# EAGLE board H3-Rev_A (EAGLE 9.6.2), part 1 of 4
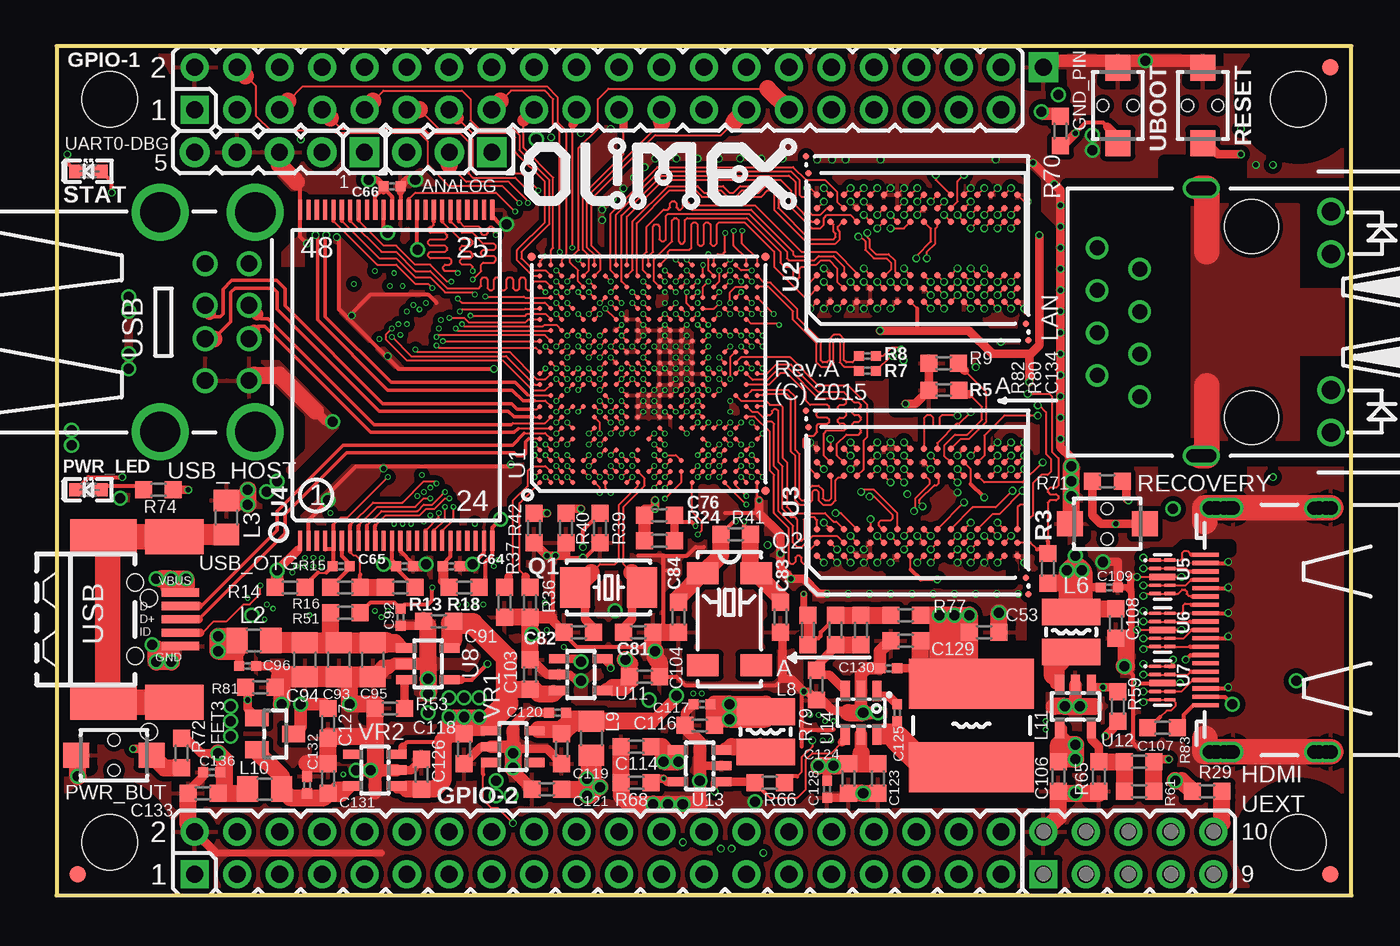
[diagram p5: board, top side]
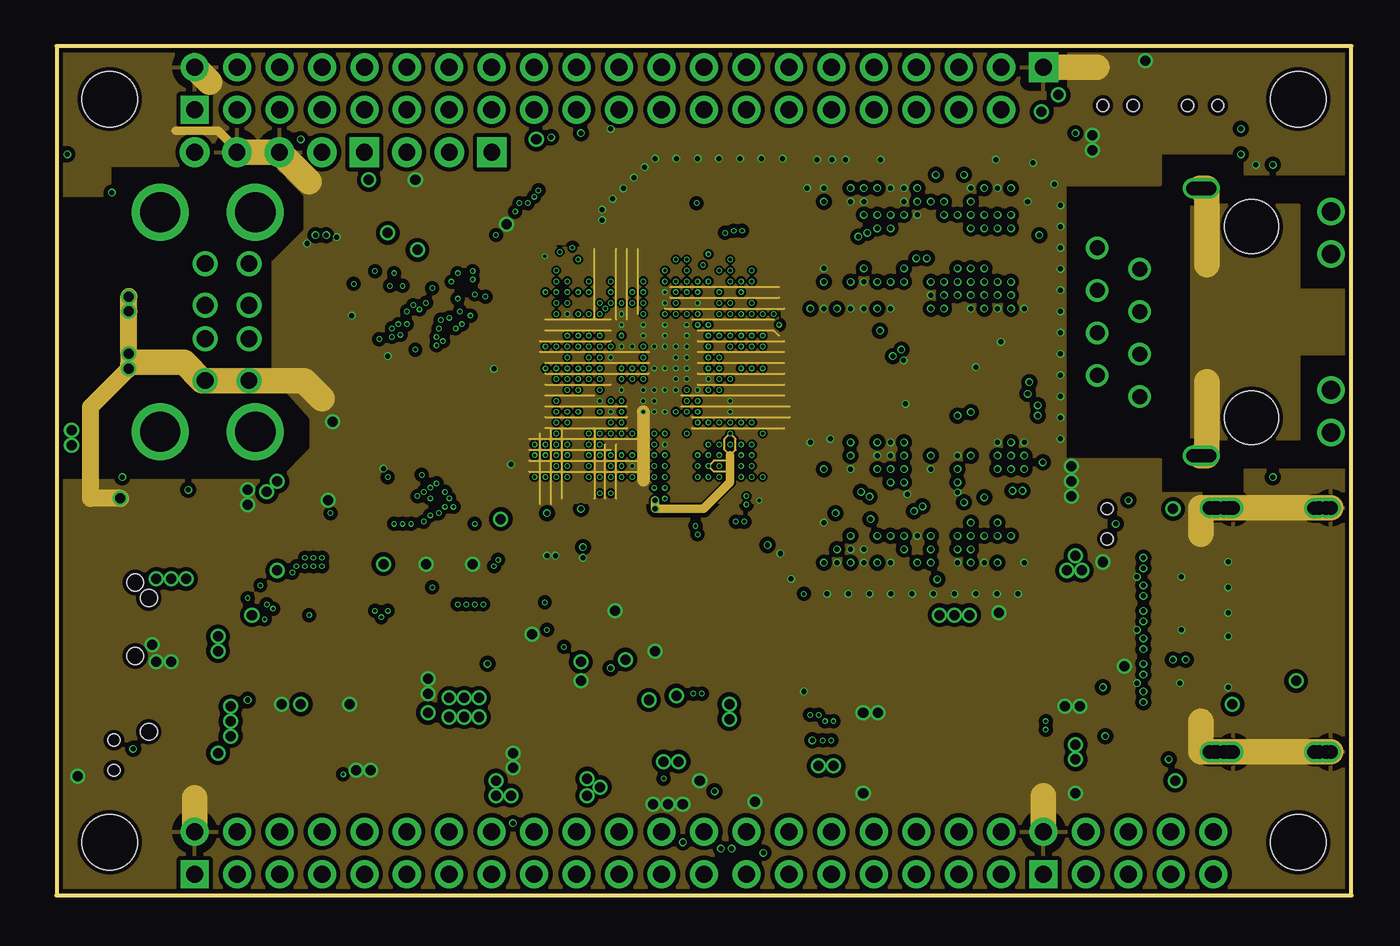
[diagram p6: board, inner layer GND]
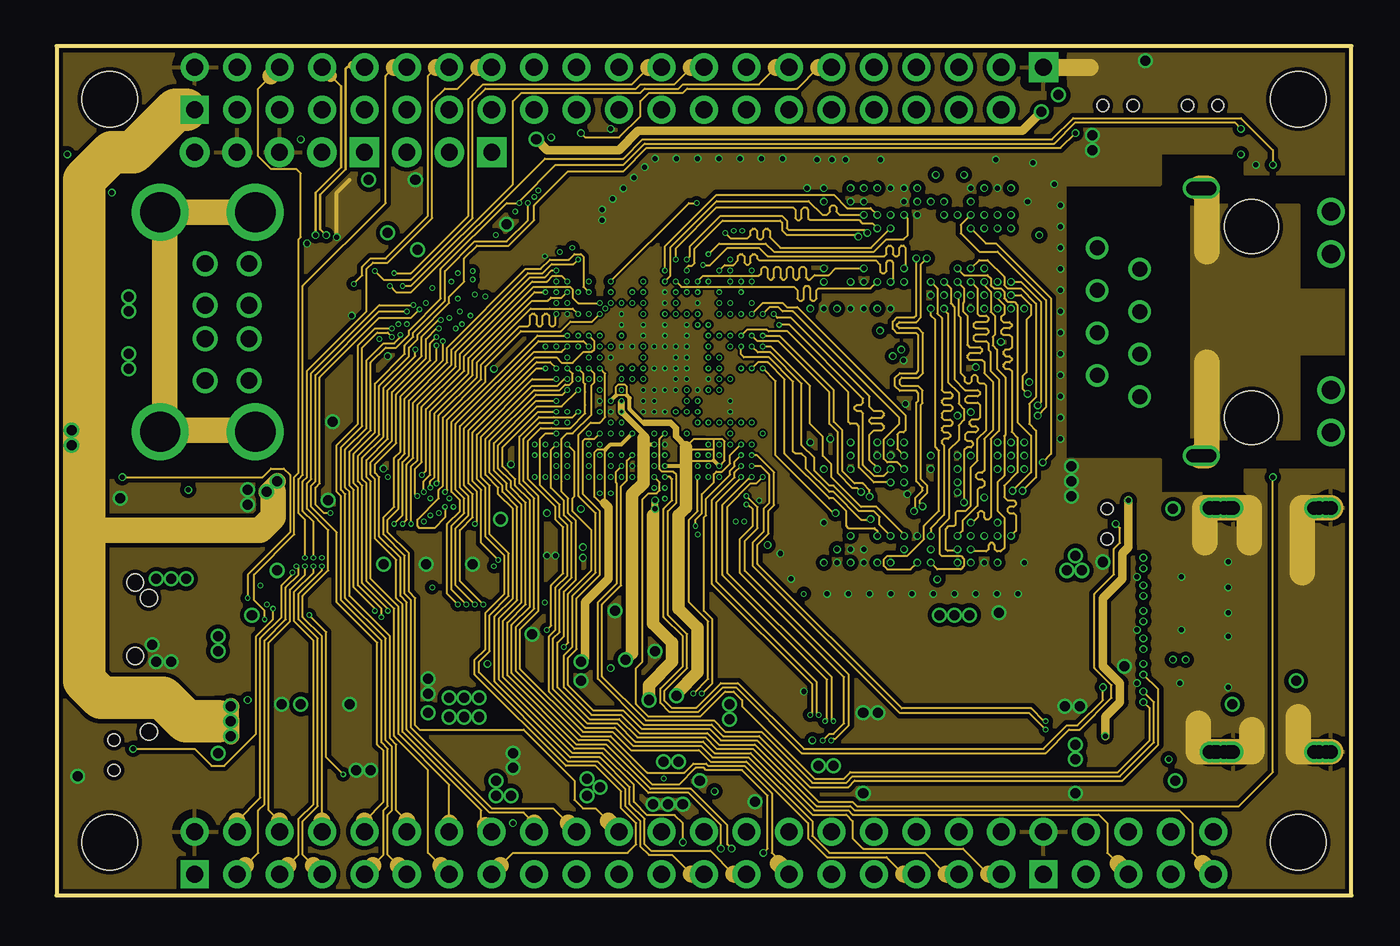
[diagram p7: board, inner layer Route3]
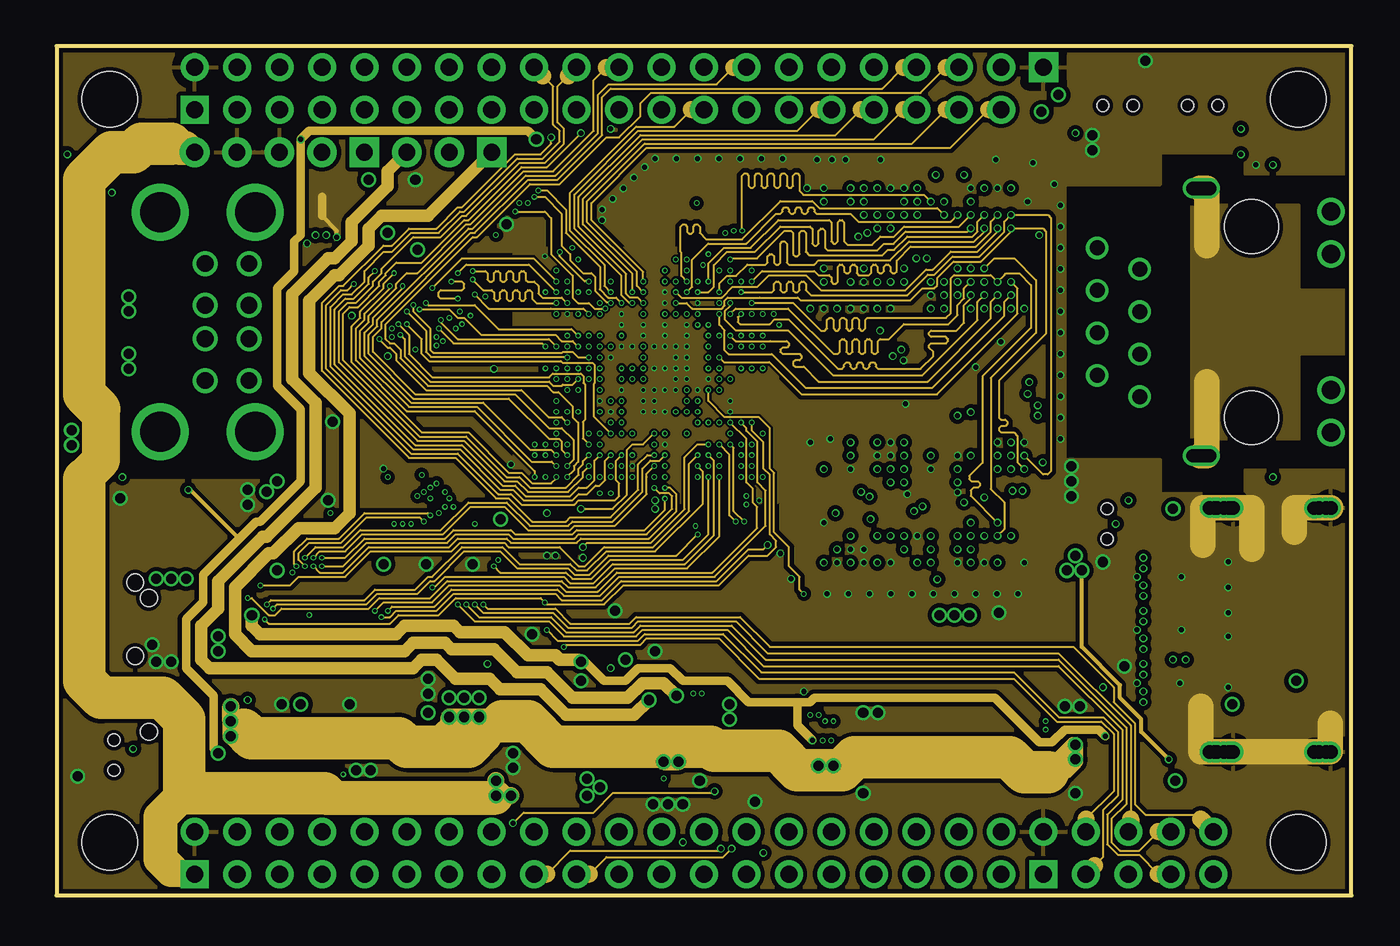
[diagram p8: board, inner layer Route14]
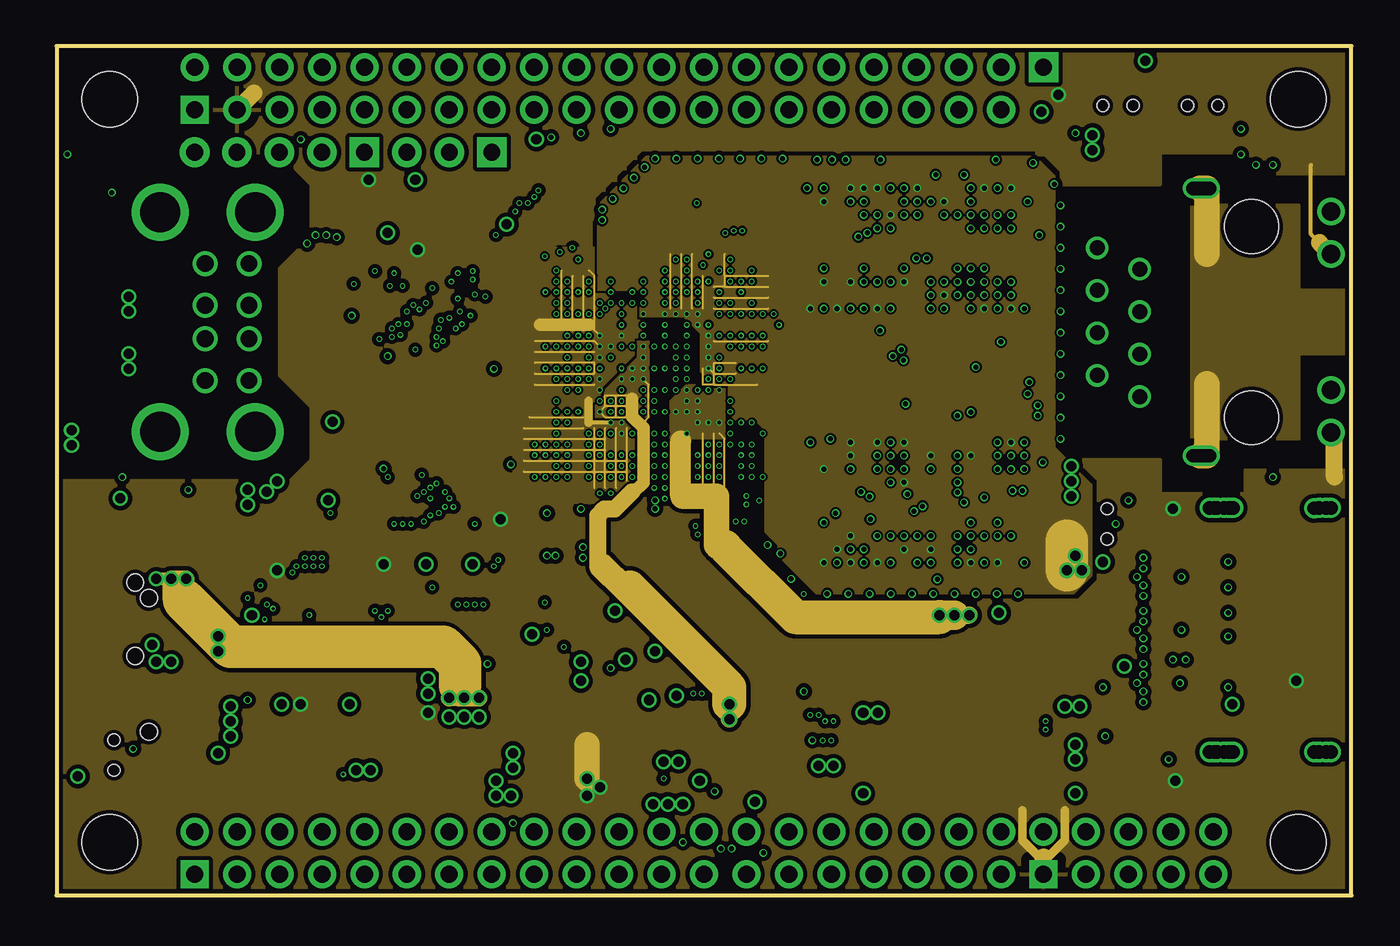
[diagram p9: board, inner layer PWR]
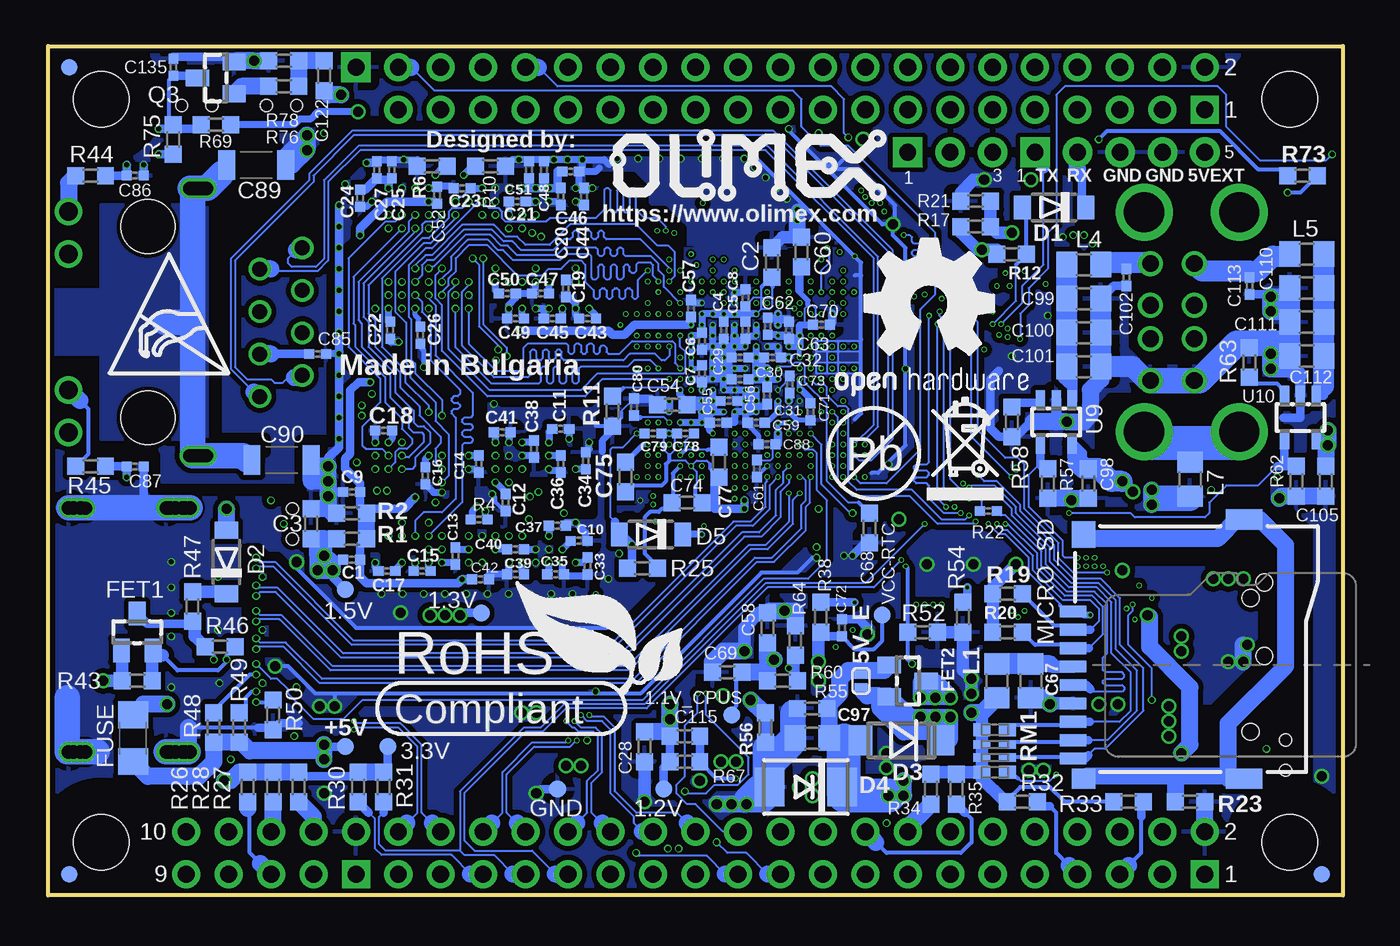
[diagram p10: board, bottom side, seen from below]

Size 77.47 x 50.8 mm. Coordinates in mm from the lower left corner, seen from the top.
Outline: 0,50.8 0,0 77.47,0 77.47,50.8 0,50.8
Copper layers (1+2*3+14*15+16): Top 0.035mm / dielectric 5mil / GND 0.035mm / dielectric 0.5mm / Route3 0.035mm / dielectric 0.2mm / Route14 0.035mm / dielectric 0.5mm / PWR 0.035mm / dielectric 5mil / Bottom 0.035mm
Design rules "default": minimum track width 4mil, minimum drill 0.2mm, track to track 5mil, track to pad 5mil, pad to pad 5mil, via to via 5mil, smd to smd 1mil, copper to edge 10mil, drill to drill 8mil, minimum pad ring 6mil, minimum via ring 2.5mil, stop-mask expansion 4mil, vias tented up to drill 28mil, thermal gap 20mil
Holes 3.3 mm at 3.17,47.62 74.3,47.62 3.17,3.17 74.3,3.17
tRestrict: area -0.3,-0.3 to 6.6,6.6; area -0.3,44.2 to 6.6,51.1; area 70.9,-0.3 to 77.7,6.6; area 70.9,44.2 to 77.7,51.1; 104 lines
bRestrict: area -0.3,-0.3 to 6.6,6.6; area -0.3,44.2 to 6.6,51.1; area 70.9,-0.3 to 77.7,6.6; area 70.9,44.2 to 77.7,51.1; 143 lines

## Footprints (pad centres in the part's own frame; a part is rotated, then mirrored left to right if it is on the bottom)
TESTPAD_40-ROUND = smd 1.016 x 1.016: 1 0,0
SJ_1_SMALLER = smd 0.508 x 0.762: 1 -0.381,0; 2 0.381,0
HN1X3 = drill 1 pad 1.778 square: 1 -2.54,0 | drill 1 pad 1.778: 2 0,0; 3 2.54,0
C0402_TI = smd 0.61 x 0.584: 1 -0.508,0; 2 0.508,0
C0603_DWS = smd 1.016 x 1.016: 1 -0.889,0; 2 0.889,0
C0805_5MIL_DWS = smd 1.27 x 1.524: 1 -1.016,0; 2 1.016,0
C1206_5MILS_WS_ISO = smd 1.016 x 1.778: 1 -1.778,0; 2 1.778,0
SOD-123 = smd 1 x 1.4: A 1.9,0; C -1.9,0
MLL-41 = smd 1.45 x 1.8: A 2.445,0; K -2.445,0
DO214AA = smd 1.778 x 2.286: A 2.177,0; C -2.177,0
SOT23 = smd 1.4 x 1: 1 1.1,-0.95; 2 1.1,0.95; 3 -1.1,0
FIDUCIAL-1X3 = smd 1 x 1: 1 0,0
1206 = smd 1.6 x 1.8: 1 -1.4,0; 2 1.4,0
TEST_PAD40/70/SQUARE = drill 1.016 pad 1.778 square: P$1 0,0
HN2X20-MALE = drill 1.016 pad 1.676 square: 1 -24.13,-1.27 | drill 1.016 pad 1.676: 2 -24.13,1.27; 3 -21.59,-1.27; 4 -21.59,1.27; 5 -19.05,-1.27; 6 -19.05,1.27; 7 -16.51,-1.27; 8 -16.51,1.27; 9 -13.97,-1.27; 10 -13.97,1.27; 11 -11.43,-1.27; 12 -11.43,1.27; 13 -8.89,-1.27; 14 -8.89,1.27; 15 -6.35,-1.27; 16 -6.35,1.27; 17 -3.81,-1.27; 18 -3.81,1.27; 19 -1.27,-1.27; 20 -1.27,1.27; 21 1.27,-1.27; 22 1.27,1.27; 23 3.81,-1.27; 24 3.81,1.27; 25 6.35,-1.27; 26 6.35,1.27; 27 8.89,-1.27; 28 8.89,1.27; 29 11.43,-1.27; 30 11.43,1.27; 31 13.97,-1.27; 32 13.97,1.27; 33 16.51,-1.27; 34 16.51,1.27; 35 19.05,-1.27; 36 19.05,1.27; 37 21.59,-1.27; 38 21.59,1.27; 39 24.13,-1.27; 40 24.13,1.27
HDMI-SWM-19 = smd 0.25 x 1.6: 1 -4.5,-5.55; 2 -4,-5.55; 3 -3.5,-5.55; 4 -3,-5.55; 5 -2.5,-5.55; 6 -2,-5.55; 7 -1.5,-5.55; 8 -1,-5.55; 9 -0.5,-5.55; 10 0,-5.55; 11 0.5,-5.55; 12 1,-5.55; 13 1.5,-5.55; 14 2,-5.55; 15 2.5,-5.55; 16 3,-5.55; 17 3.5,-5.55; 18 4,-5.55; 19 4.5,-5.55 | drill 0.8: P$5 -7.3,-4.85; P$7 -7.3,1.25; P$9 7.3,1.25; P$11 7.3,-4.85; P$13 -7.3,-4.45; P$15 -7.3,1.65; P$18 7.3,1.65; P$20 7.3,-4.45; P$21 -7.3,-4.15; P$22 -7.3,-5; P$23 7.3,-5; P$24 7.3,-4.15; P$25 -7.3,-5.3; P$26 7.3,-5.3; P$27 7.3,0.95; P$28 -7.275,0.95; SH1 -7.3,-3.9; SH2 -7.3,1.95; SH3 7.3,1.95; SH4 7.3,-3.9
L0805_5MIL_DWS = smd 1.27 x 1.524: 1 -1.016,0; 2 1.016,0
CD32 = smd 1.6 x 3.5: 1 -1.2,0; 2 1.2,0
CD73(75) = smd 3 x 7.5: 1 -2.5,0; 2 2.5,0
RJLBC-060TC1_MILLING = drill 0.9: 1 -4.455,6.7; 2 -3.185,9.24; 3 -1.915,6.7; 4 -0.645,9.24; 5 0.625,6.7; 6 1.895,9.24; 7 3.165,6.7; 8 4.435,9.24 | drill 0.8: _1 -8,2.5; _2 -8,2.7; _3 -8,2.9; _4 -8,3.3; _5 -8,3.5; _6 8,3.5; _7 8,3.3; _8 8,2.9; _9 8,2.7; _10 8,2.5; GND1 -8,3.1; GND2 8,3.1 | drill 1.1: AG 4.07,-4.748; AY -6.61,-4.748; KG 6.61,-4.748; KY -4.07,-4.748 | hole 3.2: -5.715,0; 5.715,0
TFC-WPAPR-08 = smd 1.6 x 0.7: 1 -7.375,2.25; 2 -7.375,1.15; 3 -7.375,0.05; 4 -7.375,-1.05; 5 -7.375,-2.15; 6 -7.375,-3.25; 7 -7.375,-4.35; 8 -7.375,-5.45; 9 -7.375,-6.55 | smd 1.4 x 1.2: 10 -6.75,-7.75 | smd 1.4 x 1.6: 11 -6.75,6.85 | smd 2.2 x 1.2: 12 2.85,-7.75; 13 2.85,7.75 | hole 1: 3.25,-4.95; 3.25,3.05
IT1185AU2 = smd 1.55 x 1.5: 1 -2.25,0; 2 2.25,0 | hole 0.7: 0,-0.9; 0,0.9
LED-0603_TEST = smd 0.8 x 0.8: A 0.762,0; C -0.762,0
HCX-4S = smd 1.8 x 2.4: 1 -2,0; 2 2,0
MC-306 = smd 1.3 x 1.9: 1 -2.75,-1.6; 2 2.75,-1.6; 3 2.75,1.6; 4 -2.75,1.6
R0603_5MIL_DWS = smd 1.016 x 1.016: 1 -0.889,0; 2 0.889,0
R0402_TI = smd 0.61 x 0.584: 1 -0.508,0; 2 0.508,0
0603_0R = smd 1.016 x 1.016: 1 -0.889,0; 2 0.889,0
R_MATRIX_4 = smd 0.762 x 1.016: 1.1 -1.27,-0.762; 1.2 -1.27,0.762; 4.1 1.27,-0.762; 4.2 1.27,0.762 | smd 0.508 x 1.016: 2.1 -0.381,-0.762; 2.2 -0.381,0.762; 3.1 0.381,-0.762; 3.2 0.381,0.762
FBGA-347 = smd 0.3 x 0.3: A1 -6.5,-6.5; A2 -6.5,-5.85; A3 -6.5,-5.2; A4 -6.5,-4.55; A5 -6.5,-3.9; A7 -6.5,-2.6; A8 -6.5,-1.95; A10 -6.5,-0.65; A11 -6.5,0; A13 -6.5,1.3; A14 -6.5,1.95; A16 -6.5,3.25; A17 -6.5,3.9; A19 -6.5,5.2; A20 -6.5,5.85; A21 -6.5,6.5; AA1 6.5,-6.5; AA2 6.5,-5.85; AA3 6.5,-5.2; AA5 6.5,-3.9; AA6 6.5,-3.25; AA8 6.5,-1.95; AA9 6.5,-1.3; AA11 6.5,0; AA12 6.5,0.65; AA14 6.5,1.95; AA15 6.5,2.6; AA17 6.5,3.9; AA18 6.5,4.55; AA19 6.5,5.2; AA20 6.5,5.85; AA21 6.5,6.5; B1 -5.85,-6.5; B2 -5.85,-5.85; B3 -5.85,-5.2; B4 -5.85,-4.55; B5 -5.85,-3.9; B6 -5.85,-3.25; B7 -5.85,-2.6; B8 -5.85,-1.95; B9 -5.85,-1.3; B10 -5.85,-0.65; B11 -5.85,0; B12 -5.85,0.65; B13 -5.85,1.3; B14 -5.85,1.95; B15 -5.85,2.6; B16 -5.85,3.25; B17 -5.85,3.9; B18 -5.85,4.55; B19 -5.85,5.2; B20 -5.85,5.85; B21 -5.85,6.5; C1 -5.2,-6.5; C2 -5.2,-5.85; C3 -5.2,-5.2; C5 -5.2,-3.9; C6 -5.2,-3.25; C7 -5.2,-2.6; C8 -5.2,-1.95; C9 -5.2,-1.3; C10 -5.2,-0.65; C11 -5.2,0; C12 -5.2,0.65; C13 -5.2,1.3; C14 -5.2,1.95; C15 -5.2,2.6; C16 -5.2,3.25; C17 -5.2,3.9; C18 -5.2,4.55; C19 -5.2,5.2; C20 -5.2,5.85; C21 -5.2,6.5; D1 -4.55,-6.5; D2 -4.55,-5.85; D3 -4.55,-5.2; D5 -4.55,-3.9; D6 -4.55,-3.25; D8 -4.55,-1.95; D10 -4.55,-0.65; D11 -4.55,0; D13 -4.55,1.3; D15 -4.55,2.6; D17 -4.55,3.9; D19 -4.55,5.2; D20 -4.55,5.85; E2 -3.9,-5.85; E3 -3.9,-5.2; E8 -3.9,-1.95; E10 -3.9,-0.65; E11 -3.9,0; E13 -3.9,1.3; E14 -3.9,1.95; E15 -3.9,2.6; E16 -3.9,3.25; E18 -3.9,4.55; E19 -3.9,5.2; E20 -3.9,5.85; E21 -3.9,6.5; F1 -3.25,-6.5; F2 -3.25,-5.85; F3 -3.25,-5.2; F5 -3.25,-3.9; F6 -3.25,-3.25; F7 -3.25,-2.6; F8 -3.25,-1.95; F10 -3.25,-0.65; F11 -3.25,0; F13 -3.25,1.3; F14 -3.25,1.95; F16 -3.25,3.25; F17 -3.25,3.9; F18 -3.25,4.55; F19 -3.25,5.2; F20 -3.25,5.85; F21 -3.25,6.5; G1 -2.6,-6.5; G2 -2.6,-5.85; G4 -2.6,-4.55; G5 -2.6,-3.9; G7 -2.6,-2.6; G8 -2.6,-1.95; G9 -2.6,-1.3; G10 -2.6,-0.65; G11 -2.6,0; G12 -2.6,0.65; G13 -2.6,1.3; G14 -2.6,1.95; G15 -2.6,2.6; G18 -2.6,4.55; G20 -2.6,5.85; H2 -1.95,-5.85; H3 -1.95,-5.2; H4 -1.95,-4.55; H6 -1.95,-3.25; H7 -1.95,-2.6; H8 -1.95,-1.95; H10 -1.95,-0.65; H11 -1.95,0; H12 -1.95,0.65; H13 -1.95,1.3; H14 -1.95,1.95; H15 -1.95,2.6; H16 -1.95,3.25; H17 -1.95,3.9; H18 -1.95,4.55; H19 -1.95,5.2; H20 -1.95,5.85; H21 -1.95,6.5; J1 -1.3,-6.5; J2 -1.3,-5.85; J3 -1.3,-5.2; J6 -1.3,-3.25; J7 -1.3,-2.6; J8 -1.3,-1.95; J9 -1.3,-1.3; J10 -1.3,-0.65; J11 -1.3,0; J12 -1.3,0.65; J13 -1.3,1.3; J14 -1.3,1.95; J15 -1.3,2.6; J16 -1.3,3.25; J19 -1.3,5.2; J20 -1.3,5.85; J21 -1.3,6.5; K1 -0.65,-6.5; K2 -0.65,-5.85; K3 -0.65,-5.2; K4 -0.65,-4.55; K6 -0.65,-3.25; K7 -0.65,-2.6; K8 -0.65,-1.95; K9 -0.65,-1.3; K10 -0.65,-0.65; K11 -0.65,0; K12 -0.65,0.65; K13 -0.65,1.3; K14 -0.65,1.95; K15 -0.65,2.6; K16 -0.65,3.25; K17 -0.65,3.9; K18 -0.65,4.55; K20 -0.65,5.85; L2 0,-5.85; L5 0,-3.9; L8 0,-1.95; L9 0,-1.3; L10 0,-0.65; L11 0,0; L12 0,0.65; L13 0,1.3; L14 0,1.95; L15 0,2.6; L16 0,3.25; L17 0,3.9; L18 0,4.55; L19 0,5.2; L20 0,5.85; L21 0,6.5; M1 0.65,-6.5; M2 0.65,-5.85; M3 0.65,-5.2; M4 0.65,-4.55; M5 0.65,-3.9; M6 0.65,-3.25; M7 0.65,-2.6; M8 0.65,-1.95; M9 0.65,-1.3; M10 0.65,-0.65; M11 0.65,0; M12 0.65,0.65; M13 0.65,1.3; M14 0.65,1.95; M15 0.65,2.6; M16 0.65,3.25; M19 0.65,5.2; M20 0.65,5.85; M21 0.65,6.5; N1 1.3,-6.5; N2 1.3,-5.85; N3 1.3,-5.2; N7 1.3,-2.6; N8 1.3,-1.95; N9 1.3,-1.3; N10 1.3,-0.65; N11 1.3,0; N12 1.3,0.65; N13 1.3,1.3; N14 1.3,1.95; N15 1.3,2.6; N16 1.3,3.25; N17 1.3,3.9; N19 1.3,5.2; N20 1.3,5.85; P2 1.95,-5.85; P3 1.95,-5.2; P6 1.95,-3.25; P7 1.95,-2.6; P8 1.95,-1.95; P9 1.95,-1.3; P10 1.95,-0.65; P11 1.95,0; P12 1.95,0.65; P13 1.95,1.3; P14 1.95,1.95; P15 1.95,2.6; P16 1.95,3.25; P17 1.95,3.9; P19 1.95,5.2; P20 1.95,5.85; P21 1.95,6.5; R1 2.6,-6.5; R2 2.6,-5.85; R6 2.6,-3.25; R7 2.6,-2.6; R8 2.6,-1.95; R9 2.6,-1.3; R10 2.6,-0.65; R11 2.6,0; R12 2.6,0.65; R13 2.6,1.3; R14 2.6,1.95; R16 2.6,3.25; R17 2.6,3.9; R18 2.6,4.55; R19 2.6,5.2; R20 2.6,5.85; R21 2.6,6.5; T2 3.25,-5.85; T3 3.25,-5.2; T4 3.25,-4.55; T5 3.25,-3.9; T6 3.25,-3.25; T7 3.25,-2.6; T8 3.25,-1.95; T9 3.25,-1.3; T10 3.25,-0.65; T11 3.25,0; T12 3.25,0.65; T13 3.25,1.3; T14 3.25,1.95; T15 3.25,2.6; T16 3.25,3.25; T17 3.25,3.9; T18 3.25,4.55; T20 3.25,5.85; U2 3.9,-5.85; U3 3.9,-5.2; U4 3.9,-4.55; U6 3.9,-3.25; U9 3.9,-1.3; U11 3.9,0; U15 3.9,2.6; U16 3.9,3.25; U18 3.9,4.55; U19 3.9,5.2; U20 3.9,5.85; U21 3.9,6.5; V1 4.55,-6.5; V2 4.55,-5.85; V3 4.55,-5.2; V4 4.55,-4.55; V5 4.55,-3.9; V6 4.55,-3.25; V10 4.55,-0.65; V11 4.55,0; V12 4.55,0.65; V13 4.55,1.3; V15 4.55,2.6; V17 4.55,3.9; V19 4.55,5.2; V20 4.55,5.85; V21 4.55,6.5; W1 5.2,-6.5; W2 5.2,-5.85; W3 5.2,-5.2; W5 5.2,-3.9; W6 5.2,-3.25; W9 5.2,-1.3; W11 5.2,0; W12 5.2,0.65; W13 5.2,1.3; W15 5.2,2.6; W17 5.2,3.9; W18 5.2,4.55; W20 5.2,5.85; W21 5.2,6.5; Y1 5.85,-6.5; Y2 5.85,-5.85; Y3 5.85,-5.2; Y4 5.85,-4.55; Y7 5.85,-2.6; Y8 5.85,-1.95; Y9 5.85,-1.3; Y10 5.85,-0.65; Y11 5.85,0; Y12 5.85,0.65; Y13 5.85,1.3; Y14 5.85,1.95; Y15 5.85,2.6; Y16 5.85,3.25; Y17 5.85,3.9; Y18 5.85,4.55; Y19 5.85,5.2; Y20 5.85,5.85; Y21 5.85,6.5 | smd 0.5 x 0.5: FID1 -7,7; FID2 7,7; FID3 7,-7
FBGA96(HYNIX_SAMSUNG_512MX16_DDR3) = smd 0.4 x 0.4: A1 -6,-3.2; A2 -6,-2.4; A3 -6,-1.6; A7 -6,1.6; A8 -6,2.4; A9 -6,3.2; B1 -5.2,-3.2; B2 -5.2,-2.4; B3 -5.2,-1.6; B7 -5.2,1.6; B8 -5.2,2.4; B9 -5.2,3.2; C1 -4.4,-3.2; C2 -4.4,-2.4; C3 -4.4,-1.6; C7 -4.4,1.6; C8 -4.4,2.4; C9 -4.4,3.2; D1 -3.6,-3.2; D2 -3.6,-2.4; D3 -3.6,-1.6; D7 -3.6,1.6; D8 -3.6,2.4; D9 -3.6,3.2; E1 -2.8,-3.2; E2 -2.8,-2.4; E3 -2.8,-1.6; E7 -2.8,1.6; E8 -2.8,2.4; E9 -2.8,3.2; F1 -2,-3.2; F2 -2,-2.4; F3 -2,-1.6; F7 -2,1.6; F8 -2,2.4; F9 -2,3.2; FID1 6.5,-4.5; FID2 -6.5,4.5; FID3 6.65,-5.5; FID4 -6.65,5.5; G1 -1.2,-3.2; G2 -1.2,-2.4; G3 -1.2,-1.6; G7 -1.2,1.6; G8 -1.2,2.4; G9 -1.2,3.2; H1 -0.4,-3.2; H2 -0.4,-2.4; H3 -0.4,-1.6; H7 -0.4,1.6; H8 -0.4,2.4; H9 -0.4,3.2; J1 0.4,-3.2; J2 0.4,-2.4; J3 0.4,-1.6; J7 0.4,1.6; J8 0.4,2.4; J9 0.4,3.2; K1 1.2,-3.2; K2 1.2,-2.4; K3 1.2,-1.6; K7 1.2,1.6; K8 1.2,2.4; K9 1.2,3.2; L1 2,-3.2; L2 2,-2.4; L3 2,-1.6; L7 2,1.6; L8 2,2.4; L9 2,3.2; M1 2.8,-3.2; M2 2.8,-2.4; M3 2.8,-1.6; M7 2.8,1.6; M8 2.8,2.4; M9 2.8,3.2; N1 3.6,-3.2; N2 3.6,-2.4; N3 3.6,-1.6; N7 3.6,1.6; N8 3.6,2.4; N9 3.6,3.2; P1 4.4,-3.2; P2 4.4,-2.4; P3 4.4,-1.6; P7 4.4,1.6; P8 4.4,2.4; P9 4.4,3.2; R1 5.2,-3.2; R2 5.2,-2.4; R3 5.2,-1.6; R7 5.2,1.6; R8 5.2,2.4; R9 5.2,3.2; T1 6,-3.2; T2 6,-2.4; T3 6,-1.6; T7 6,1.6; T8 6,2.4; T9 6,3.2
TSOP48 = smd 1.2 x 0.25: 1 -9.9,5.75; 2 -9.9,5.25; 3 -9.9,4.75; 4 -9.9,4.25; 5 -9.9,3.75; 6 -9.9,3.25; 7 -9.9,2.75; 8 -9.9,2.25; 9 -9.9,1.75; 10 -9.9,1.25; 11 -9.9,0.75; 12 -9.9,0.25; 13 -9.9,-0.25; 14 -9.9,-0.75; 15 -9.9,-1.25; 16 -9.9,-1.75; 17 -9.9,-2.25; 18 -9.9,-2.75; 19 -9.9,-3.25; 20 -9.9,-3.75; 21 -9.9,-4.25; 22 -9.9,-4.75; 23 -9.9,-5.25; 24 -9.9,-5.75; 25 9.9,-5.75; 26 9.9,-5.25; 27 9.9,-4.75; 28 9.9,-4.25; 29 9.9,-3.75; 30 9.9,-3.25; 31 9.9,-2.75; 32 9.9,-2.25; 33 9.9,-1.75; 34 9.9,-1.25; 35 9.9,-0.75; 36 9.9,-0.25; 37 9.9,0.25; 38 9.9,0.75; 39 9.9,1.25; 40 9.9,1.75; 41 9.9,2.25; 42 9.9,2.75; 43 9.9,3.25; 44 9.9,3.75; 45 9.9,4.25; 46 9.9,4.75; 47 9.9,5.25; 48 9.9,5.75
SLP2510P8 = smd 0.2 x 0.675: 1 -1,-0.438; 2 -0.5,-0.438; 4 0.5,-0.438; 5 1,-0.438; 6 1,0.438; 7 0.5,0.438; 9 -0.5,0.438; 10 -1,0.438 | smd 0.4 x 0.775: 3 0,-0.388; 8 0,0.388
SOT23-5 = smd 1.2 x 0.55: 1 1.3,-0.95; 2 1.3,0; 3 1.3,0.95; 4 -1.3,0.95; 5 -1.3,-0.95
SOT-23-5 = smd 1.2 x 0.55: 1 1.3,-0.95; 2 1.3,0; 3 1.3,0.95; 4 -1.3,0.95; 5 -1.3,-0.95
SOT23-6 = smd 1.2 x 0.55: 1 1.3,-0.95; 2 1.3,0; 3 1.3,0.95; 4 -1.3,0.95; 5 -1.3,0; 6 -1.3,-0.95
HN1X5 = drill 1 pad 1.778 square: 1 -5.08,0 | drill 1 pad 1.778: 2 -2.54,0; 3 0,0; 4 2.54,0; 5 5.08,0
ML10_NEW = drill 1.016 pad 1.676 square: 1 -5.08,-1.27 | drill 1.016 pad 1.676: 2 -5.08,1.27; 3 -2.54,-1.27; 4 -2.54,1.27; 5 0,-1.27; 6 0,1.27; 7 2.54,-1.27; 8 2.54,1.27; 9 5.08,-1.27; 10 5.08,1.27
USB_TWO_LEVEL = drill 1: 1.1 -3.5,2.62; 1.2 -1,2.62; 1.3 1,2.62; 1.4 3.5,2.62; 2.1 -3.5,0; 2.2 -1,0; 2.3 1,0; 2.4 3.5,0 | drill 2.4: GND1 -6.57,-2.7; GND2 6.57,-2.7; GND3 6.57,3; GND4 -6.57,3
USB_MINI_9PIN = smd 2.25 x 0.5: D+ 2.706,0; D- 2.706,0.8; GND 2.706,-1.6; ID 2.706,-0.8; VBUS 2.706,1.6 | smd 4 x 2.1: GND1 -1.9,4.95; GND3 -1.9,-4.95 | smd 3.5 x 2.1: GND2 2.35,4.95; GND4 2.35,-4.95 | hole 1: 0,2.2; 0,-2.2

## Placement (x,y rotation side)
1.1V_CPUS  TESTPADTESTPAD_40-ROUND  [TESTPAD_40-ROUND]  36.58,10.79 180 bottom
1.2V  TESTPADTESTPAD_40-ROUND  [TESTPAD_40-ROUND]  40.64,6.35 180 bottom
1.3V  TESTPADTESTPAD_40-ROUND  [TESTPAD_40-ROUND]  51.56,16.89 180 bottom
1.5V  TESTPADTESTPAD_40-ROUND  [TESTPAD_40-ROUND]  59.69,18.29 90 bottom
3.3V  TESTPADTESTPAD_40-ROUND  [TESTPAD_40-ROUND]  57.15,8.89 180 bottom
5V_E  Open  [SJ_1_SMALLER]  28.83,12.83 270 bottom
+5V  TESTPADTESTPAD_40-ROUND  [TESTPAD_40-ROUND]  59.69,8.89 90 bottom
ANALOG  NA(HN1X3)  [HN1X3]  23.5,44.45 180 top
C1  100nF  [C0402_TI]  59.31,20.07 0 bottom
C2  22uF/6.3V  [C0603_DWS]  34.16,37.85 90 bottom
C3  1uF  [C0603_DWS]  61.72,22.23 90 bottom
C4  100nF  [C0402_TI]  37.05,33.8 90 bottom
C5  100nF  [C0402_TI]  35.75,33.8 90 bottom
C6  100nF  [C0402_TI]  38.35,33.15 90 bottom
C7  100nF  [C0402_TI]  38.35,31.2 90 bottom
C8  100nF  [C0402_TI]  35.75,35.75 270 bottom
C9  100nF  [C0402_TI]  59.31,24.13 0 bottom
C10  100nF  [C0402_TI]  45.7,21.2 180 bottom
C11  100nF  [C0402_TI]  46.8,27.9 180 bottom
C12  100nF  [C0402_TI]  50.1,23.5 90 bottom
C13  100nF  [C0402_TI]  53.1,20.3 90 bottom
C14  100nF  [C0402_TI]  51.7,25.8 90 bottom
C15  100nF  [C0402_TI]  55.1,19.4 0 bottom
C16  100nF  [C0402_TI]  54.9,25.1 90 bottom
C17  100nF  [C0402_TI]  57.2,19.4 0 bottom
C18  100nF  [C0402_TI]  57.4,27.8 0 bottom
C19  100nF  [C0402_TI]  46.5,36.3 90 bottom
C20  100nF  [C0402_TI]  46.8,41.8 90 bottom
C21  100nF  [C0402_TI]  49.4,41.5 180 bottom
C22  100nF  [C0402_TI]  57,33.8 90 bottom
C23  100nF  [C0402_TI]  52.7,42.3 0 bottom
C24  100nF  [C0402_TI]  58.8,41.7 90 bottom
C25  100nF  [C0402_TI]  56.9,43.4 270 bottom
C26  100nF  [C0402_TI]  55.2,33.5 90 bottom
C27  100nF  [C0402_TI]  57.8,43.4 270 bottom
C28  22uF/6.3V  [C0603_DWS]  41.78,8.89 270 bottom
C29  100nF  [C0402_TI]  36.08,32.17 0 bottom
C30  100nF  [C0402_TI]  36.08,30.88 0 bottom
C31  100nF  [C0402_TI]  34.45,29.9 90 bottom
C32  100nF  [C0402_TI]  34.12,32.17 180 bottom
C33  100nF  [C0402_TI]  45.2,19.7 90 bottom
C34  100nF  [C0402_TI]  45.3,26 270 bottom
C35  100nF  [C0402_TI]  47.1,19.2 180 bottom
C36  100nF  [C0402_TI]  46.8,25.8 90 bottom
C37  100nF  [C0402_TI]  47,22.1 180 bottom
C38  100nF  [C0402_TI]  48.4,26.7 90 bottom
C39  100nF  [C0402_TI]  49.5,19.2 0 bottom
C40  100nF  [C0402_TI]  49.5,20.7 180 bottom
C41  100nF  [C0402_TI]  50.3,27.7 180 bottom
C42  100nF  [C0402_TI]  51.6,18.9 180 bottom
C43  100nF  [C0402_TI]  45.2,34.5 0 bottom
C44  100nF  [C0402_TI]  45.4,41.8 270 bottom
C45  100nF  [C0402_TI]  47.3,34.5 0 bottom
C46  100nF  [C0402_TI]  46.2,43.3 180 bottom
C47  100nF  [C0402_TI]  48,36 0 bottom
C48  100nF  [C0402_TI]  47.8,43.4 270 bottom
C49  100nF  [C0402_TI]  49.5,34.5 0 bottom
C50  100nF  [C0402_TI]  50,36 180 bottom
C51  100nF  [C0402_TI]  48.7,43.4 270 bottom
C52  100nF  [C0402_TI]  54.2,41.88 270 bottom
C53  22uF/6.3V  [C0603_DWS]  55.5,15.75 0 top
C54  1uF  [C0603_DWS]  40.13,29.34 180 bottom
C55  100nF  [C0402_TI]  37.38,28.27 180 bottom
C56  100nF  [C0402_TI]  36.73,29.57 180 bottom
C57  100nF  [C0402_TI]  39,35.1 270 bottom
C58  1uF  [C0603_DWS]  34.42,16 90 bottom
C59  100nF  [C0402_TI]  35.1,28.27 0 bottom
C60  22uF/6.3V  [C0603_DWS]  32.38,38.48 90 bottom
C61  100nF  [C0402_TI]  35.05,25.53 90 bottom
C62  100nF  [C0402_TI]  34.42,34.04 270 bottom
C63  100nF  [C0402_TI]  33.15,33.8 270 bottom
C64  NA(100nF)  [C0402_TI]  23.62,19.68 180 top
C65  NA(100nF)  [C0402_TI]  20.83,19.68 180 top
C66  NA(100nF)  [C0402_TI]  20.07,42.42 180 top
C67  47uF/6.3V  [C0805_5MIL_DWS]  18.67,12.83 90 bottom
C68  10uF/6.3V  [C0603_DWS]  28.32,21.97 270 bottom
C69  10uF/6.3V  [C0603_DWS]  36.83,13.34 180 bottom
C70  100nF  [C0402_TI]  31.2,34.12 180 bottom
C71  100nF  [C0402_TI]  31.85,28.93 90 bottom
C72  100nF  [C0402_TI]  29.97,16 270 bottom
C73  100nF  [C0402_TI]  33.1,30.56 270 bottom
C74  10uF/6.3V  [C0603_DWS]  39.24,23.5 180 bottom
C75  1uF  [C0603_DWS]  42.93,25.02 90 bottom
C76  10uF/6.3V  [C0603_DWS]  36.07,22.73 0 top
C77  10uF/6.3V  [C0603_DWS]  37.34,25.91 90 bottom
C78  100nF  [C0402_TI]  39.33,27.62 0 bottom
C79  100nF  [C0402_TI]  41.27,27.62 180 bottom
C80  100nF  [C0402_TI]  42.42,29.21 270 bottom
C81  33pF  [C0603_DWS]  34.8,15.75 180 top
C82  33pF  [C0603_DWS]  31.24,15.75 0 top
C83  10pF  [C0603_DWS]  43.31,16.64 90 top
C84  10pF  [C0603_DWS]  37.21,16.64 90 top
C85  100nF  [C0402_TI]  61.34,32.38 180 bottom
C86  NA(100nF)  [C0402_TI]  72.26,43.05 180 bottom
C87  NA(100nF)  [C0402_TI]  72.26,25.65 180 bottom
C88  100nF  [C0402_TI]  34.45,26.98 0 bottom
C89  NA  [C1206_5MILS_WS_ISO]  65.02,43.69 180 bottom
C90  1nF/2kV/X7R/1206  [C1206_5MILS_WS_ISO]  63.5,26.04 180 bottom
C91  22uF/6.3V  [C0603_DWS]  22.86,16.38 180 top
C92  100nF  [C0402_TI]  20.57,16.64 270 top
C93  47uF/6.3V  [C0805_5MIL_DWS]  16.89,14.1 270 top
C94  47uF/6.3V  [C0805_5MIL_DWS]  14.86,14.1 270 top
C95  47uF/6.3V  [C0805_5MIL_DWS]  18.92,14.1 270 top
C96  100nF  [C0402_TI]  11.43,13.72 0 top
C97  47uF/6.3V  [C0805_5MIL_DWS]  31.75,9.4 180 bottom
C98  22uF/6.3V  [C0603_DWS]  15.24,24.64 270 bottom
C99  47uF/6.3V  [C0805_5MIL_DWS]  15.49,35.69 0 bottom
C100  47uF/6.3V  [C0805_5MIL_DWS]  15.49,33.66 0 bottom
C101  47uF/6.3V  [C0805_5MIL_DWS]  15.49,31.62 0 bottom
C102  100nF  [C0402_TI]  12.95,36.96 270 bottom
C103  NA(22uF/6.3V)  [C0603_DWS]  28.32,13.21 90 top
C104  NA(22uF/6.3V)  [C0603_DWS]  35.18,13.08 0 top
C105  22uF/6.3V  [C0603_DWS]  1.02,24.77 270 bottom
C106  22uF/6.3V  [C0603_DWS]  59.94,7.11 270 top
C107  33pF  [C0603_DWS]  64.77,8 180 top
C108  22uF/6.3V  [C0603_DWS]  63.37,16.26 270 top
C109  100nF  [C0402_TI]  62.99,18.41 0 top
C110  47uF/6.3V  [C0805_5MIL_DWS]  2.16,36.32 180 bottom
C111  47uF/6.3V  [C0805_5MIL_DWS]  2.16,34.29 180 bottom
C112  47uF/6.3V  [C0805_5MIL_DWS]  2.16,32.26 180 bottom
C113  100nF  [C0402_TI]  5.59,36.45 270 bottom
C114  22uF/6.3V  [C0603_DWS]  34.67,8.89 180 top
C115  33pF  [C0603_DWS]  39.37,9.53 0 bottom
C116  22uF/6.3V  [C0603_DWS]  38.48,10.16 180 top
C117  100nF  [C0402_TI]  38.61,11.43 180 top
C118  22uF/6.3V  [C0603_DWS]  24.38,8.76 270 top
C119  22uF/6.3V  [C0603_DWS]  30.23,8.76 270 top
C120  100nF  [C0402_TI]  29.97,10.92 180 top
C121  NA  [C0603_DWS]  29.34,6.35 180 top
C122  10uF/6.3V  [C0603_DWS]  60.96,49.02 90 bottom
C123  22uF/6.3V  [C0603_DWS]  49.15,6.99 270 top
C124  22uF/6.3V  [C0603_DWS]  47.37,6.99 270 top
C125  100nF  [C0402_TI]  50.29,10.92 90 top
C126  22uF/6.3V  [C0603_DWS]  21.84,7.24 90 top
C127  22uF/6.3V  [C0603_DWS]  16.26,10.29 270 top
C128  100nF  [C0402_TI]  46.1,6.35 90 top
C129  22uF/6.3V  [C0603_DWS]  50.8,15.24 180 top
C130  100nF  [C0402_TI]  49.78,13.59 180 top
C131  22uF/6.3V  [C0603_DWS]  16.26,6.99 90 top
C132  100nF  [C0402_TI]  14.99,6.6 90 top
C133  22uF/6.3V  [C0603_DWS]  8.76,6.1 180 top
C134  NA  [C0603_DWS]  48.13,15.88 270 top
C135  NA(100nF)  [C0402_TI]  69.98,49.53 270 bottom
C136  100nF  [C0402_TI]  9.27,7.37 0 top
D1  1N5819(S4SOD-123)  [SOD-123]  17.27,41.15 180 bottom
D2  1N5819(S4SOD-123)  [SOD-123]  66.8,19.94 90 bottom
D3  1N5822/SS34/SMA  [MLL-41]  26.42,9.27 180 bottom
D4  SMBJ6.0A  [DO214AA]  32.13,6.48 180 bottom
D5  1N5819(S4SOD-123)  [SOD-123]  41.4,21.59 180 bottom
FET1  NA(BSS138(SOT23-3))  [SOT23]  72.14,15.75 270 bottom
FET2  IRLML6402  [SOT23]  26.04,12.83 180 bottom
FET3  IRLML6402  [SOT23]  13.08,9.65 180 top
FID1  FIDUCIAL  [FIDUCIAL-1X3]  76.2,49.53 90 top
FID2  FIDUCIAL  [FIDUCIAL-1X3]  1.27,1.27 90 top
FID3  FIDUCIAL  [FIDUCIAL-1X3]  76.2,1.27 180 top
FID4  FIDUCIAL  [FIDUCIAL-1X3]  76.2,1.27 180 bottom
FID5  FIDUCIAL  [FIDUCIAL-1X3]  76.2,49.53 0 bottom
FID6  FIDUCIAL  [FIDUCIAL-1X3]  1.27,1.27 0 bottom
FUSE  FSMD035  [1206]  72.39,9.4 90 bottom
GND  TESTPADTESTPAD_40-ROUND  [TESTPAD_40-ROUND]  46.99,6.35 180 bottom
GND_PIN  TESTPAD3  [TEST_PAD40/70/SQUARE]  59.05,49.53 0 top
GPIO-1  NA(HN2X20)  [HN2X20-MALE]  32.38,48.26 0 top
GPIO-2  NA(HN2X20)  [HN2X20-MALE]  32.38,2.54 0 top
HDMI  HDMI-SWM-19  [HDMI-SWM-19]  74.3,15.88 270 top
L1  FB0805/600R/2A  [L0805_5MIL_DWS]  20.7,12.83 90 bottom
L2  FB0805/600R/2A  [L0805_5MIL_DWS]  11.81,15.24 0 top
L3  FB0805/600R/2A  [L0805_5MIL_DWS]  10.16,22.61 270 top
L4  FB0805/600R/2A  [L0805_5MIL_DWS]  15.49,37.72 0 bottom
L5  FB0805/600R/2A  [L0805_5MIL_DWS]  2.16,38.35 180 bottom
L6  2.2uH/2.0A/DCR<0.1R/CD32  [CD32]  60.71,15.75 90 top
L7  FB0805/600R/2A  [L0805_5MIL_DWS]  9.14,24.89 90 bottom
L8  2.2uH/2.0A/DCR<0.1R/CD32  [CD32]  42.42,9.78 90 top
L9  NA(FB0805/600R/2A)  [L0805_5MIL_DWS]  32,9.4 270 top
L10  FB0805/600R/2A  [L0805_5MIL_DWS]  12.45,6.35 180 top
L11  2.2uH/4.5A/DCR<0.1R/CD75  [CD73(75)]  54.74,10.16 90 top
LAN  RJLBC-060TC1  [RJLBC-060TC1_MILLING]  71.5,34.29 90 top
MICRO_SD  TFC-WPAPR-08  [TFC-WPAPR-08]  8.76,14.73 0 bottom
PWR_BUT  IT1185AU2  [IT1185AU2]  3.43,8.38 180 top
PWR_LED  LED/RED/0603  [LED-0603_TEST]  1.91,24.26 0 top
Q1  E4SB24.000F20E15/5x3.2mm/20ppm/20pF  [HCX-4S]  33.02,18.41 0 top
Q2  MC-306_32.768KHZ/SMD_8038/6pF  [MC-306]  40.26,16.51 270 top
Q3  BC817-40(SOT23)  [SOT23]  67.44,48.9 0 bottom
R1  2k/1%  [R0603_5MIL_DWS]  59.31,21.34 180 bottom
R2  2k/1%  [R0603_5MIL_DWS]  59.31,22.86 0 bottom
R3  2k/1%  [R0603_5MIL_DWS]  59.31,19.56 270 top
R4  NA(100R)  [R0402_TI]  51.69,22.48 0 bottom
R5  243R/1%  [R0603_5MIL_DWS]  53.09,30.23 0 top
R6  243R/1%  [R0603_5MIL_DWS]  54.5,43.6 0 bottom
R7  22R  [R0402_TI]  48.51,31.37 180 top
R8  22R  [R0402_TI]  48.51,32.26 180 top
R9  NA(243R/1%)  [R0603_5MIL_DWS]  53.08,31.83 0 top
R10  NA(243R/1%)  [R0603_5MIL_DWS]  51,43.6 180 bottom
R11  243R/1%  [R0603_5MIL_DWS]  43.69,28.96 90 bottom
R12  10k  [R0603_5MIL_DWS]  19.81,38.35 180 bottom
R13  NA(10k)  [R0603_5MIL_DWS]  20.57,18.41 180 top
R14  NA(10k)  [R0603_5MIL_DWS]  13.97,18.41 0 top
R15  NA(22R)  [R0402_TI]  17.02,19.68 0 top
R16  NA  [R0603_5MIL_DWS]  17.27,18.41 0 top
R17  NA  [R0603_5MIL_DWS]  21.97,40.01 0 bottom
R18  NA(10k)  [R0603_5MIL_DWS]  24.38,18.41 180 top
R19  100k  [R0603_5MIL_DWS]  20.07,18.03 180 bottom
R20  10k  [R0603_5MIL_DWS]  20.07,15.75 180 bottom
R21  NA  [R0603_5MIL_DWS]  21.97,41.53 180 bottom
R22  22R  [R0402_TI]  21.21,22.99 180 bottom
R23  10k  [R0603_5MIL_DWS]  9.14,5.59 0 bottom
R24  200k/1%  [R0603_5MIL_DWS]  36.07,21.21 180 top
R25  100k  [R0603_5MIL_DWS]  41.91,19.56 0 bottom
R26  2k/1%  [R0603_5MIL_DWS]  65.53,6.48 270 bottom
R27  10k  [R0603_5MIL_DWS]  62.48,6.48 270 bottom
R28  2k/1%  [R0603_5MIL_DWS]  64.01,6.48 270 bottom
R29  10k  [R0603_5MIL_DWS]  68.83,6.22 0 top
R30  NA  [R0603_5MIL_DWS]  58.93,6.48 270 bottom
R31  NA  [R0603_5MIL_DWS]  57.4,6.48 270 bottom
R32  NA  [R0603_5MIL_DWS]  19.18,5.59 0 bottom
R33  NA  [R0603_5MIL_DWS]  12.83,5.59 0 bottom
R34  NA  [R0603_5MIL_DWS]  24.64,6.35 270 bottom
R35  NA  [R0603_5MIL_DWS]  23.11,6.35 270 bottom
R36  NA  [R0603_5MIL_DWS]  28.32,17.53 270 top
R37  NA  [R0603_5MIL_DWS]  26.8,17.53 270 top
R38  10k  [R0603_5MIL_DWS]  31.24,16.64 270 bottom
R39  NA  [R0603_5MIL_DWS]  32.51,21.97 270 top
R40  NA  [R0603_5MIL_DWS]  30.48,21.97 270 top
R41  10M  [R0603_5MIL_DWS]  40.64,21.59 180 top
R42  6.04k/1%  [R0603_5MIL_DWS]  28.57,21.97 270 top
R43  NA(27k)  [R0603_5MIL_DWS]  72.14,12.83 180 bottom
R44  560R  [R0603_5MIL_DWS]  74.93,43.05 0 bottom
R45  560R  [R0603_5MIL_DWS]  74.93,25.65 0 bottom
R46  560R  [R0603_5MIL_DWS]  67.18,14.86 0 bottom
R47  27k  [R0603_5MIL_DWS]  68.83,17.27 270 bottom
R48  2k/1%  [R0603_5MIL_DWS]  67.56,10.03 270 bottom
R49  2k/1%  [R0603_5MIL_DWS]  66.04,10.03 270 bottom
R50  10k  [R0603_5MIL_DWS]  64.01,10.79 270 bottom
R51  4.99k/1%  [R0603_5MIL_DWS]  17.27,16.89 180 top
R52  10k  [R0603_5MIL_DWS]  25.15,15.75 180 bottom
R53  13k/1%  [R0603_5MIL_DWS]  19.94,11.18 0 top
R54  10k  [R0603_5MIL_DWS]  22.73,16.64 90 bottom
R55  10k  [R0603_5MIL_DWS]  31.75,11.18 0 bottom
R56  0R(Board_Mounted)  [0603_0R]  34.54,10.03 90 bottom
R57  10k  [R0603_5MIL_DWS]  17.65,24.64 90 bottom
R58  6.81k/1%  [R0603_5MIL_DWS]  19.81,28.32 90 bottom
R59  10k  [R0603_5MIL_DWS]  63.5,11.3 90 top
R60  NA(7.5k/1%)  [R0603_5MIL_DWS]  33.53,12.83 0 bottom
R61  4.99k/1%  [R0603_5MIL_DWS]  64.77,6.22 180 top
R62  10k  [R0603_5MIL_DWS]  2.79,24.77 90 bottom
R63  13k/1%  [R0603_5MIL_DWS]  5.59,31.88 270 bottom
R64  NA(20k/1%)  [R0603_5MIL_DWS]  32.77,15.24 270 bottom
R65  3.32k/1%  [R0603_5MIL_DWS]  62.36,7.11 270 top
R66  10k  [R0603_5MIL_DWS]  42.67,6.73 180 top
R67  4.99k/1%  [R0603_5MIL_DWS]  39.37,8 0 bottom
R68  4.99k/1%  [R0603_5MIL_DWS]  34.67,6.73 180 top
R69  10k  [R0603_5MIL_DWS]  67.44,46.1 180 bottom
R70  10k  [R0603_5MIL_DWS]  60.07,45.72 270 top
R71  10k  [R0603_5MIL_DWS]  62.87,24.77 180 top
R72  10k  [R0603_5MIL_DWS]  7.49,8.51 270 top
R73  2k/1%  [R0603_5MIL_DWS]  2.41,43.05 0 bottom
R74  2k/1%  [R0603_5MIL_DWS]  6.1,24.26 180 top
R75  243R/1%  [R0603_5MIL_DWS]  69.98,45.21 90 bottom
R76  10k  [R0603_5MIL_DWS]  63.37,48.39 180 bottom
R77  NA  [R0603_5MIL_DWS]  50.8,16.76 180 top
R78  10k  [R0603_5MIL_DWS]  63.37,49.91 180 bottom
R79  6.04k/1%  [R0603_5MIL_DWS]  45.47,12.57 270 top
R80  6.81k/1%  [R0603_5MIL_DWS]  46.61,15.88 90 top
R81  100k  [R0603_5MIL_DWS]  12.19,12.45 0 top
R82  0R(Board_Mounted)  [0603_0R]  44.96,15.88 270 top
R83  4.99k/1%  [R0603_5MIL_DWS]  66.17,10.03 0 top
RECOVERY  IT1185AU2  [IT1185AU2]  62.87,22.23 180 top
RESET  IT1185AU2  [IT1185AU2]  68.58,47.24 90 top
RM1  RA1206_(4X0603)_4B8_100k  [R_MATRIX_4]  20.83,8.64 90 bottom
STAT  LED/GREEN/0603  [LED-0603_TEST]  1.91,43.31 0 top
U1  ALLWINNER-H3(FBGA-347)  [FBGA-347]  35.42,31.2 0 top
U2  K4B4G1646D-BCK0(FBGA-96_256Mx16_DDR3-1600_11-11-11)  [FBGA96(HYNIX_SAMSUNG_512MX16_DDR3)]  51.5,38.7 0 top
U3  K4B4G1646D-BCK0(FBGA-96_256Mx16_DDR3-1600_11-11-11)  [FBGA96(HYNIX_SAMSUNG_512MX16_DDR3)]  51.5,23.5 0 top
U4  NA(H27UBG8T2BTR-BC)  [TSOP48]  20.32,31.11 90 top
U5  NA(RCLAMP0524P)  [SLP2510P8]  66.17,19.05 270 top
U6  NA(RCLAMP0524P)  [SLP2510P8]  66.17,15.88 270 top
U7  NA(RCLAMP0524P)  [SLP2510P8]  66.17,12.7 270 top
U8  SY6280AAC(SOT23-5)  [SOT23-5]  22.23,13.84 180 top
U9  SY6280AAC(SOT23-5)  [SOT23-5]  17.14,28.32 90 bottom
U10  SY6280AAC(SOT23-5)  [SOT23-5]  2.54,28.57 90 bottom
U11  NA(APL5315)  [SOT-23-5]  31.37,13.21 180 top
U12  SY8009AAAC(SOT23-5)  [SOT23-5]  60.96,11.3 90 top
U13  SY8089AAAC(SOT23-5)  [SOT23-5]  38.48,7.75 0 top
U14  SY8113ADC(SOT23-6)  [SOT23-6]  48.13,10.92 90 top
U$1  [LOGO-OPENHARDWARE_8X8]  24.77,35.31 0 bottom
U$6  [OLIMEX1_V]  45.47,40.89 0 top
U$8  [OLIMEX1_V]  26.16,41.4 0 bottom
U$9  [PB]  28.07,26.42 0 bottom
U$10  [ESD_SYMBOL]  73.79,31.24 0 bottom
U$11  [RECYCLE_BIN1/8]  24.89,23.62 0 bottom
U$12  [ROHS]  56.77,10.29 0 bottom
UART0-DBG  NA(HN1X5)  [HN1X5]  13.34,44.45 180 top
UBOOT  IT1185AU2  [IT1185AU2]  63.5,47.24 90 top
UEXT  HN2x5  [ML10_NEW]  64.14,2.54 0 top
USB_HOST  USB_TWO_LEVEL  [USB_TWO_LEVEL]  8.89,34.29 270 top
USB_OTG  USB-OTG  [USB_MINI_9PIN]  4.7,16.51 0 top
VCC-RTC  TESTPADTESTPAD_40-ROUND  [TESTPAD_40-ROUND]  27.56,16.76 180 bottom
VR1  LC1463CB5ATR33(SOT23-5)  [SOT-23-5]  27.3,8.89 180 top
VR2  LC1463CB5ATR33(SOT23-5)  [SOT-23-5]  19.05,7.49 0 top

## Tracks (layer width: path | path; a pad name or v marks a point on that pad's centre or on a via)
+5V  (via drill 0.6)
  Top 0.254: 20.7,8.89 20.95,9.14 23.11,9.14
  Top 0.508: 23.62,16.26 C91.1 | U8.5 23.62,14.79 23.62,15.24 | VR2.1 20.35,6.35 20.95,6.35 | VR2.3 20.7,8.44 20.7,8.89 | 26.04,10.29 26.04,9.84 VR1.1 26,9.91 25.53,9.91 | U11.3 30.07,12.06 29.72,12.06 | U13.4 37.21,8.7 37.21,8.38 | 46.1,7.75 C128.2 | U12.4 60.2,10 60.2,9.27
  Top 0.762: 24.38,9.91 25.53,9.91 | 48.13,8.51 U14.5
  Top 0.889: v24.38,10.67 v25.27,10.67 | v24.38,10.67 v23.5,10.67 23.5,9.65 | C118.1 24.38,9.91 v24.38,10.67
  Top 1.016: C118.1 23.5,9.65 23.11,9.27 23.11,9.14 23.11,6.86 22.61,6.35 C126.1 20.95,6.35 | 26.92,12.32 C103.1 28.57,12.32 28.83,12.06 29.72,12.06 | C114.1 36.2,8.89 36.32,8.76 v36.32,8 v37.21,8 37.21,8.38 | 48.13,7.87 C124.1 46.86,7.87 46.74,7.75 v46.48,7.75 46.1,7.75 v45.59,7.75 | 48.13,7.87 C123.1 | 48.13,7.87 48.13,8.51 | 59.94,8.13 C106.1 | 59.94,8.13 v60.96,8.13 v60.96,9.02 60.2,9.02 | 59.94,8.13 59.94,9.02 60.2,9.02 | 60.2,9.02 60.2,9.27
  Top 1.27: 23.62,15.24 23.62,16.26 24.89,16.26 26.92,14.22 26.92,12.32 26.92,11.56 | 26.04,10.29 26.04,10.54
  Top 1.397: 26.04,10.54 26.92,11.43 26.92,11.56
  Route3 1.016: 9.65,10.41 v10.41,10.41 | 12.95,24.13 v12.57,24.13 v13.21,24.77 | v10.41,10.41 v10.41,9.53 | v10.41,10.41 v10.41,11.3 | 1.65,27.81 v0.89,27.81
  Route3 1.524: 7.75,46.99 GPIO-1.1 | 1.65,21.84 12.19,21.84 12.95,22.61 12.95,24.13
  Route3 2.54: 7.75,46.99 7.11,46.99 4.57,44.45 3.3,44.45 1.65,42.8 1.65,27.81 1.65,21.84 1.65,12.83 2.67,11.81 6.35,11.81 7.75,10.41 9.65,10.41
  Route14 0.889: v60.96,9.02 v60.96,8.13 60.96,8 60.33,7.37 59.31,7.37 59.31,7.49 60.83,9.02 v60.96,9.02
  Route14 1.016: v10.41,10.41 10.67,10.41 11.18,9.91 | 26.67,10.41 26.42,10.67 v25.27,10.67 v24.38,10.67 v23.5,10.67 23.5,10.29 23.11,9.91 23.11,8.89 | v10.41,10.41 v10.41,11.3 | v10.41,10.41 v10.41,9.53 | 36.32,8.89 v36.32,8 v37.21,8 | 46.74,7.49 v46.48,7.75
  Route14 2.54: 11.18,9.91 11.68,9.4 20.45,9.4 20.95,8.89 23.11,8.89 24.64,8.89 25.4,9.65 | 26.67,10.41 28.19,10.41 29.72,8.89 36.32,8.89 39.12,8.89 39.37,8.64 43.18,8.64 44.32,7.49 46.74,7.49 46.99,7.49 47.75,8.26 57.02,8.26 57.91,7.37 59.31,7.37
  Bottom 0.508: U10.5 1.59,27.3 0.89,27.3 | 28.7,12.19 28.83,12.32 5V_E.2 | 60.96,8.89 +5V.1
  Bottom 0.635: 15.88,25.91 16.2,26.23 U9.5 15.62,26.45 15.62,25.65
  Bottom 0.762: v12.57,24.13 v13.21,24.77
  Bottom 0.889: 24.38,9.27 D3.K 23.5,9.27 v23.5,10.67 v24.38,10.67 | v24.38,10.67 24.38,9.78 | v24.38,10.67 v25.27,10.67 25.91,10.67
  Bottom 1.016: 69.09,7.11 68.45,7.11 67.56,8 R48.2 R49.2 65.91,9.14 65.41,8.64 60.96,8.64 | 69.09,7.11 69.22,7.11 | C105.1 1.02,26.92 v0.89,26.92 0.89,27.3 v0.89,27.81 | 28.7,12.19 28.45,11.94 27.69,11.94 | 27.69,11.94 27.14,11.94 FET2.2 27.12,11.88 25.91,10.67 | 24.38,9.27 C118.1 24.38,9.78 26.29,9.78 27.69,11.18 27.69,11.94 | FUSE.1 71.5,7.11 69.09,7.11 | v60.96,9.02 60.96,8.89 60.96,8.64 | v60.96,8.13 60.96,8.64
  Bottom 1.27: v13.21,24.77 13.84,24.77 14.61,25.53 C98.1 15.49,25.53 15.62,25.65 15.88,25.91
+5V_OTG_PWR  (via drill 0.6)
  Top 0.508: C96.1 10.92,14.48 10.79,14.61 | 7.75,18.41 7.75,18.11 USB_OTG.VBUS 6.73,18.11 6.73,18.41
  Top 0.762: v5.97,18.92 6.22,18.92
  Top 1.016: 7.75,18.41 v7.75,18.92 v6.86,18.92 6.73,18.92 | 6.73,18.92 6.22,18.92 | 6.73,18.92 6.73,18.41 | 10.79,15.49 L2.1 10.79,14.61 v9.65,14.61 v9.65,15.49 10.79,15.49
  PWR 0.762: v6.86,18.92 v5.97,18.92
  PWR 1.016: 24.13,11.81 v23.5,11.81 | v25.27,11.81 v24.38,11.81 24.13,11.81 | 24.13,12.57 24.13,11.81 | v9.65,14.61 9.65,14.86 | v9.65,15.49 9.65,14.86 | 9.65,14.86 10.41,14.86 | v7.75,18.92 v6.86,18.92 6.86,17.65 7.62,17.65
  PWR 2.54: 7.62,17.65 10.41,14.86 23.11,14.86 24.13,13.84 24.13,12.57
  Bottom 0.889: v24.38,11.81 v25.27,11.81 25.27,12.83 FET2.3 24.38,12.83 | v24.38,11.81 v23.5,11.81 23.5,11.94 24.38,12.83 | v24.38,11.81 24.38,12.83
+7V  (via drill 0.2, 0.3, 0.6)
  Top 0.127: v34.45,27.62 U1.K6 | 44.32,7.11 44.58,7.37 44.58,8.26 45.21,8.89 v45.21,9.27
  Top 0.254: 44.32,7.11 43.56,7.11 R66.1
  Top 0.508: v7.87,24.26 R74.1 | v62.74,9.53 63.25,10.03 63.25,10.16 R59.1 | 10.03,7.37 C136.2 | R72.1 7.75,9.4 8.64,8.51 v9.65,8.51 | U11.1 31.18,14.16 v31.37,13.97 | v64.14,23.62 64.01,23.75 64.01,24.51 R71.1
  Top 0.762: v58.93,46.86 59.05,46.74 60.07,46.74 R70.1
  Top 1.016: L10.2 11.18,6.1 10.03,6.1 | 10.03,6.1 C133.1 | 10.03,6.1 10.03,7.37 10.03,8.13 v9.65,8.51
  Route3 0.107: 32.83,23.47 32.83,26.65 32.33,26.65 32.17,26.5 32.17,23.83
  Route3 0.127: 32.83,23.47 32.77,23.47 32.54,23.47 32.17,23.83
  Route3 0.254: 32.83,26.65 33.15,26.98 33.8,26.98 v34.45,27.62
  Route3 0.508: v28.7,45.21 29.34,44.58 33.66,44.58 34.8,45.72 57.78,45.72 v58.93,46.86 | v31.37,13.97 31.62,14.22 31.62,17.53 33.02,18.92 33.02,23.22 32.77,23.47 | v62.74,9.53 62.74,10.67 63.63,11.56 63.63,12.7 62.61,13.72 62.61,17.78 63.75,18.92 63.75,20.45 64.14,20.83 v64.14,23.62
  Route14 0.254: v7.87,24.26 8,24.26 10.92,21.34
  Route14 0.508: v28.7,45.21 28.19,45.72 15.11,45.72 v14.61,45.21 14.61,39.5 14.22,39.12 14.22,37.34 13.21,36.32 13.21,30.48 14.61,29.08 14.61,24.77 12.19,22.35 11.94,22.35 10.92,21.34 8.76,19.18 8.76,17.53 7.75,16.51 7.75,13.59 9.4,11.94 9.4,8.76 v9.65,8.51 | v31.37,13.97 31.62,13.97 32.77,12.83 34.04,12.83 34.8,13.59 36.7,13.59 37.47,12.83 40.13,12.83 41.4,11.56 44.32,11.56 | 44.32,11.56 45.09,11.56 45.34,11.81 56.13,11.81 58.8,9.14 59.56,9.14 60.33,9.91 62.36,9.91 v62.74,9.53 | v45.21,9.27 44.32,10.16 44.32,11.56
  Route14 0.762: v31.37,13.97 31.24,14.1 30.1,14.1 29.84,14.35 28.19,14.35 26.8,15.75 24.13,15.75 23.75,16.13 20.83,16.13 20.32,15.62 12.19,15.62 11.68,16.13 v11.68,16.76
  Bottom 0.254: R73.1 3.68,43.43 5.08,43.43 7.37,45.72 14.1,45.72 v14.61,45.21 | C72.2 29.21,14.73 28.07,14.73 27.56,15.24 VCC-RTC.1
  Bottom 0.406: R69.1 62.74,46.1 62.41,46.43 61.77,46.43 61.34,46.86 v58.93,46.86
  Bottom 0.508: 31.37,15.49 C72.2
  Bottom 0.762: 11.56,16.64 v11.68,16.76 | v31.37,13.97 31.37,15.49 31.37,15.75 R38.2
  Bottom 1.016: v9.65,8.51 9.14,9.02 9.14,12.45 11.56,14.86 11.56,16.64
+15V  (via drill 0.6)
  Route14 1.016: v26.29,5.97 v26.29,6.86 | v26.29,5.97 v27.18,5.97 | 26.29,5.84 v26.29,5.97
  Route14 1.524: GPIO-2.1 7.11,1.27 6.86,1.52 | 6.86,44.96 7.75,44.96 UART0-DBG.5 7.37,44.45 6.86,44.96
  Route14 2.032: 16,6.1 16,5.84 26.29,5.84 | 6.86,1.52 6.22,2.16 6.22,4.7 7.62,6.1
  Route14 2.286: 2.54,29.08 2.67,28.96 2.67,26.04 1.65,25.02 1.65,24.89
  Route14 2.54: 6.86,44.96 5.08,44.96 4.57,44.45 3.3,44.45 1.65,42.8 1.65,29.97 2.54,29.08 | 1.65,24.89 1.65,12.83 2.67,11.81 6.35,11.81 7.62,10.54 7.62,6.1 16,6.1
  Bottom 0.508: 28.83,13.46 5V_E.1
  Bottom 1.016: 29.84,5.97 29.95,5.97 D4.C | D3.A 29.84,9.27 30.73,9.27 C97.1 30.73,11.18 | 30.73,11.18 R55.2 | 30.73,11.18 30.73,11.43 30.1,12.06 30.1,12.95 29.59,13.46 28.83,13.46 27.45,13.46 FET2.1 | v26.29,5.97 v26.29,6.86 v27.18,5.97 v26.29,5.97
  Bottom 2.032: 29.84,9.27 29.84,5.97 v27.18,5.97
AP-NMI#  (via drill 0.2)
  Top 0.127: v41.6,28.27 U1.AA6
  Route3 0.127: 12.83,49.02 12.06,48.26 12.06,44.2 12.83,43.43 14.35,43.43 14.61,43.18 14.61,39.37 14.48,39.24 14.48,25.27 14.22,25.02 14.22,21.59 11.81,19.18 11.81,17.65 12.45,17.02 v12.45,16.51
  Route3 1.016: 12.83,49.02 GPIO-1.6
  Route14 0.107: 42.29,27.11 41.6,27.8
  Route14 0.127: 41.6,27.8 v41.6,28.27 | v12.45,16.51 12.7,16.26 19.94,16.26 20.45,16.76 22.86,16.76 23.88,17.78 28.96,17.78 v29.21,17.53 29.34,17.4 32.77,17.4 33.91,18.54 39.62,18.54 41.4,20.32 42.55,20.32 43.05,20.83 43.05,21.21 42.67,21.59 42.67,25.15 42.29,25.53 42.29,27.11
  Bottom 0.508: v29.21,17.53 R38.1
AP-RESET#  (via drill 0.2, 0.3)
  Top 0.127: 11.3,49.02 11.94,48.39 11.94,46.61 12.83,45.72 16.64,45.72 16.76,45.59 21.72,45.59 22.23,45.09 22.23,43.69 23.5,42.42 26.67,42.42 v27.69,41.4 | v40.3,28.27 U1.V6
  Top 1.016: 11.3,49.02 GPIO-1.4
  Route3 0.127: v70.87,45.85 70.48,46.23 60.96,46.23 59.69,44.96 35.18,44.96 33.91,43.69 29.84,43.69 27.69,41.53 v27.69,41.4 26.92,41.4 22.99,37.47 22.99,35.69 21.08,33.78 21.08,33.53 20.32,32.77 19.68,32.77 18.8,31.88 18.8,27.81 17.53,26.54 17.53,24.51 17.78,24.26 17.78,18.41 19.05,17.14 v19.05,17.02
  Route14 0.107: 41.27,24.7 41.27,27.3
  Route14 0.127: v19.05,17.02 19.56,17.53 22.48,17.53 23.5,18.54 30.1,18.54 30.48,18.16 32.38,18.16 33.53,19.3 39.24,19.3 41.91,21.97 41.91,23.24 41.66,23.5 41.66,24.32 41.27,24.7 | 41.27,27.3 v40.3,28.27
  Bottom 0.107: 40.62,28.6 42.04,28.6
  Bottom 0.127: v40.3,28.27 40.62,28.6 | 42.04,28.6 42.04,28.57
  Bottom 0.254: C135.2 70.23,48.77 70.23,46.35 R75.2
  Bottom 0.305: C80.2 42.42,28.57 42.04,28.57
  Bottom 0.508: 68.33,45.97 R69.2 68.33,45.85 69.98,45.85 | Q3.3 68.66,49.02 C135.2 | v70.87,45.85 69.98,45.85 | 69.98,45.85 R75.2
EPHY_LINK_LED  (via drill 0.2, 0.3)
  Top 0.127: v28.6,25.02 U1.A2
  Route3 0.127: v72.77,43.69 72.77,44.58 70.87,46.48 60.83,46.48 59.56,45.21 35.05,45.21 33.91,44.07 29.21,44.07 21.21,36.07 20.32,36.07 v19.94,36.45
  Route14 0.127: v28.6,25.02 28.6,25.38 25.02,28.96 20.95,28.96 17.91,32 17.91,33.91 18.41,34.42 18.41,34.8 19.94,36.32 v19.94,36.45
  Bottom 0.508: v72.77,43.69 C86.2 R44.2
EPHY_RXN  (via drill 0.2)
  Top 0.127: U1.A4 v28.6,26.98
  Bottom 0.127: v28.6,26.98 28.6,27.25 27.81,28.04 27.81,38.2 34.44,44.83 58.9,44.83 60.96,42.77 60.96,38.08 61.44,37.59 62.89,37.59 63.12,37.82 63.12,38.1 62.61,38.61
  Bottom 1.016: LAN.8 62.49,38.73 62.61,38.61
EPHY_RXP  (via drill 0.2)
  Top 0.127: U1.B4 v29.25,26.98
  Bottom 0.127: v29.25,26.98 28.07,28.16 28.07,38.1 34.54,44.58 58.8,44.58 60.71,42.67 60.71,37.97 61.34,37.34 64.01,37.34 64.14,37.47
  Bottom 1.016: LAN.7 64.79,37.47 64.14,37.47
EPHY_SPD_LED  (via drill 0.2, 0.3)
  Top 0.127: v32.5,27.62 32.5,28.27 U1.F7
  Route3 0.107: 31.62,27.3 32.17,27.3
  Route3 0.127: 31.62,27.3 31.5,27.18 31.5,24 32.51,22.99 32.51,19.18 31.11,17.78 31.11,14.73 30.61,14.22 30.61,12.57 32.13,11.05 33.91,11.05 35,9.96 39.06,9.96 39.75,9.27 41.91,9.27 45.59,5.59 47.62,5.59 47.88,5.33 70.74,5.33 72.77,7.37 v72.77,25.02 | 32.17,27.3 v32.5,27.62
  Bottom 0.508: v72.77,25.02 C87.2 R45.2
EPHY_TXN  (via drill 0.2)
  Top 0.127: v28.6,26.32 U1.A3
  Bottom 0.127: v28.6,26.32 28.26,26.32 27.18,27.41 27.18,38.48 34.16,45.47 59.18,45.47 61.59,43.05 61.59,42.67 66.29,37.97 66.29,31.6 65.56,30.86 64.14,30.86 63.93,30.66 63.45,30.66 63.12,30.99 62.74,30.99
  Bottom 1.016: LAN.2 62.38,30.99 62.74,30.99
EPHY_TXP  (via drill 0.2)
  Top 0.127: v29.25,26.32 U1.B3
  Bottom 0.107: 28.23,26 28.93,26
  Bottom 0.127: 28.93,26 v29.25,26.32 | 28.23,26 26.92,27.3 26.92,38.58 34.06,45.72 59.28,45.72 61.85,43.16 61.85,42.77 66.55,38.08 66.55,31.5 65.15,30.1
  Bottom 1.016: LAN.1 64.89,29.84 65.15,30.1
GND  (via drill 0.2, 0.2 pad 0.25, 0.3, 0.3 pad 0.25, 0.6, 0.6 pad 0.25)
  Top 0.102: v33.15,32.17 U1.H12
  Top 0.127: v45.9,42.3 U2.B9 | U2.A9 45.1,42.3 v44.9,42.3 | U2.G8 v50.7,41.5 | v47.5,41.5 U2.D8 | v48.3,41.5 U2.E8 | U2.F9 v49.9,42.3 | U2.G9 v50.7,42.3 | v48.3,36.7 U2.E2 | U2.B3 v45.9,37.5 | v45.9,35.1 U2.B1 | v47.5,35.1 U2.D1 | v48.3,35.1 U2.E1 | v49.9,35.1 U2.G1 | U2.J2 v52.3,35.9 | U2.M1 v54.7,35.1 | U2.P1 v56.3,35.1 | U2.T1 v57.9,35.1 | U2.J8 v51.5,40.7 | U2.T9 57.9,41.5 v58.1,41.5 | U2.P9 v56.3,42.3 | v54.7,42.3 U2.M9 | v37.7,34.12 U1.P15 | v45.1,27.1 U3.A9 | v46.3,27.3 U3.B9 | v47.5,25.5 U3.D8 | v49.1,26.3 U3.E8 | U3.D1 v47.5,20.7 | v46.7,19.9 U3.B1 | U3.E1 v48.3,19.9 | v45.9,22.3 U3.B3 | v48.3,20.7 U3.E2 | v49.9,19.9 U3.G1 | U3.G8 v49.9,26.3 | U3.G9 v49.9,27.1 U3.F9 | v52.3,25.5 U3.J8 | U3.M9 v53.9,26.3 | U3.P9 v56.3,27.1 | v57.9,27.1 U3.T9 | v57.9,19.9 U3.T1 | U3.J2 v51.5,21.5 | v53.9,19.9 U3.M1 | v55.5,19.9 U3.P1 | v29.21,38.23 28.93,37.94 U1.A21 | v64.64,19.05 U5.3 | U5.8 v67.31,19.05 | v64.64,15.88 U6.3 | U6.8 v67.31,15.88 | U1.M5 v36.4,26.98 | U1.AA1 41.92,23.62 v42.04,23.62 | v33.8,34.77 U1.J16 | U1.M15 v36.4,34.12 U1.N15 | U1.M14 v36.4,33.48 U1.N14 | v37.7,33.48 U1.P14 | U1.R13 v37.7,32.83 U1.R14 | v37.7,32.17 U1.R12 | U1.R11 v37.7,31.52 U1.P11 | v37.7,30.88 U1.R10 | v39,30.88 U1.T11 | U1.R9 v38.35,30.23 U1.T9 | v36.4,28.93 U1.N7 | v35.75,28.93 U1.M7 | v35.1,28.93 U1.K7 | U1.N9 v37.05,30.23 U1.P10 | v36.4,30.23 U1.M9 | U1.L9 v35.75,30.23 U1.M10 | U1.L8 v35.1,29.57 U1.K8 | U1.J9 v33.8,30.23 | v33.15,28.93 U1.H8 | v35.1,30.23 U1.K9 | v37.05,30.88 U1.N10 | v35.75,31.52 U1.M11 | v35.75,32.83 U1.M13 | U1.N11 v36.4,31.52 U1.M12 | v37.05,31.52 U1.N12 | v34.45,32.83 U1.K13 | U1.J13 v33.8,32.83 | U1.K14 v35.1,33.48 U1.K15 | v33.8,34.12 U1.H15 | v35.75,29.57 U1.M8 | v36.4,32.83 U1.N13 | v37.05,32.83 U1.P13 | v37.05,32.17 U1.P12
  Top 0.127: U1.L15 v35.1,34.12 U1.K16 | U1.G8 v32.5,29.57
  Top 0.254: U4.23 25.57,20.49 v24.89,19.81 | U4.2 15.07,22.44 v16.26,23.62 | 14.35,42.67 14.57,42.45 U4.48 14.57,39.41 v14.99,38.99 | U7.3 v64.64,12.7 64.39,12.7 | HDMI.11 70.1,15.38 v70.1,15.49 | HDMI.8 70.1,16.88 v70.1,16.89 | HDMI.5 70.1,18.38 v70.1,18.41 | HDMI.2 70.1,19.88 v70.1,19.94 | U7.8 v67.21,12.7 | 64.64,8.89 64.39,9.14 64.39,12.7 | 29.72,20.32 29.72,16.64 29.52,16.64 | C104.2 37.08,13.08 37.59,12.57 43.05,12.57 43.43,12.95 | 36.32,15.75 36.32,19.43 | 36.32,19.43 36.32,20.32 | 36.32,20.32 34.8,20.32 | 36.32,20.32 37.72,20.32 38.23,20.83 38.73,20.83 | C82.1 30.35,15.62 31.11,14.86 35.69,14.86 | 17.4,34.54 16.89,35.05 16.89,39.24 v16.76,39.37 | 17.4,34.54 20.45,31.5 v26.16,31.5 | 16.26,24 17.91,25.65 19.56,25.65 | 19.56,25.65 v19.56,25.53 | 19.56,25.65 27.05,25.65 v27.18,25.78 | 44.58,9.91 44.58,12.06 v44.7,12.19 | 44.58,9.91 44.58,8.89 | U4.36 20.57,42.04 | U4.13 20.57,20.58 21.34,19.81 C65.1 | 42.04,22.86 40.01,22.86 | 64.39,12.7 64.39,13.21 v63.88,13.72 | R39.2 31.62,20.19 v31.5,20.19 30.61,20.19 30.48,20.32 | U4.25 26.07,40.6 26.54,40.13 v26.92,40.13 | HDMI.17 70.03,12.38 v70.1,12.45 | 36.32,19.43 37.21,19.43 | 17.4,34.54 18.8,35.94 22.23,35.94 22.73,35.43 | 44.58,9.91 46.48,9.91
  Top 0.381: 64.01,15.37 64.31,15.37 64.31,15.88 | 64.31,15.88 v64.64,15.88 | 64.31,15.88 64.31,18.11 64.26,18.16 64.01,18.41 C109.2
  Top 0.406: C66.1 20.57,42.04 | 64.26,18.16 64.26,19.05 v64.64,19.05 | 9.53,2.54 19.43,2.54
  Top 0.508: 38.48,7.75 U13.2 | C83.1 43.43,15.75 43.43,12.95 43.94,12.95 v44.7,12.19 44.96,12.19 R79.2 45.82,11.68 46.46,11.05 46.99,11.05 47.12,10.92 47.37,10.92 | v42.04,23.62 42.04,22.86 43.31,21.59 v43.31,20.45 43.31,19.56 v43.94,18.92 44.7,18.92 45.59,18.03 v46.1,18.03 | v60.71,25.65 60.71,26.16 60.07,26.8 v60.07,27.3 v60.07,28.57 v60.07,29.84 v60.07,31.11 v60.07,32.38 v60.07,33.66 v60.07,34.92 v60.07,36.2 v60.07,37.47 v60.07,38.73 v60.07,40.01 v60.07,41.27 60.07,42.16 v59.69,42.55 v58.42,43.81 | C66.1 20.95,42.8 v21.46,42.8 | C82.1 29.72,16.38 29.72,16.64 | C119.2 29.34,8.76 27.3,8.76 | 22.23,16.13 C92.2 | 19.56,13.59 19.81,13.84 20.24,13.84 19.86,13.46 19.43,13.46 | C96.2 12.83,13.72 13.46,13.08 | VR2.2 21.21,7.49 C126.2 | C132.2 14.99,7.87 | C136.1 8.76,7.11 7.87,6.22 C133.2 | USB_OTG.GND 6.86,14.91 6.86,14.48 | VR1.2 25.4,8.89 C118.2 | C120.2 28.07,10.92 27.3,10.16 27.3,9.91 | v31.37,12.83 31.11,12.83 30.73,13.21 U11.2 29.34,13.21 28.45,14.1 C103.2 | C117.2 37.59,10.92 C116.2 | C128.1 47.12,5.84 C124.2 | C109.2 63.5,19.94 v62.61,19.94 | R42.2 v29.34,20.32 29.72,20.32 v29.84,20.32 30.48,20.32 R40.2 | R9.1 R5.1 51.37,29.4 v50.8,29.4 | 15.49,28.96 16.13,28.32 v16.51,28.32 | GPIO-2.2 9.53,2.54
  Top 0.61: C65.1 21.97,19.68 v22.1,19.81 | C64.1 24.77,19.68 v24.89,19.81
  Top 0.762: 38.48,5.46 v38.48,6.86 38.48,7.75 38.48,9.14 37.59,10.03 C116.2 | C121.2 27.3,7.49 v27.3,7.62 | 63.5,49.91 v65.15,49.91 68.58,49.91 RESET.2 | 63.5,49.91 UBOOT.2 | GND_PIN.P$1 59.05,49.91 63.5,49.91 | 20.24,13.84 U8.2 22.23,13.84 | 19.18,7.49 VR2.2 | v18.8,7.49 v17.91,7.49 | 19.05,7.49 19.05,6.1 | 5.97,14.76 5.97,14.86 5.84,14.99 v5.71,14.99 | VR1.2 27.3,8.89 27.3,9.91 | R36.2 29.52,16.64 | v48.26,10.92 v49.15,10.92 | 48.13,10.92 48.13,12.19 | 48.13,12.19 U14.2 | C129.2 49.28,14.61 C130.2 48.51,13.59 48.13,13.21 48.13,12.19 | 60.96,11.3 U12.2
  Top 1.016: C114.2 R68.2 33.78,5.97 34.29,5.46 v35.69,5.46 v36.58,5.46 v37.47,5.46 38.48,5.46 | 47.37,10.92 48.13,10.92 v48.26,10.92 | UART0-DBG.3 13.34,43.69 14.35,42.67 | 11.43,23.62 10.79,23.62 | v11.43,23.37 11.43,23.62 | v11.43,24.26 11.43,23.62 | C91.2 22.23,16.13 22.23,13.84 v22.23,12.95 v22.23,12.06 | C95.2 19.05,13.08 19.43,13.46 19.56,13.59 | 13.46,12.45 R81.2 | 13.46,12.45 v13.46,11.43 | 13.46,13.08 13.46,12.45 | 19.05,9.53 16.26,9.53 C127.2 C131.2 14.99,7.87 | 19.05,9.53 R53.1 19.05,11.43 v17.53,11.43 17.53,13.08 | 19.05,7.49 v18.8,7.49 | 19.05,7.49 19.18,7.49 | 19.05,9.53 19.05,7.49 | PWR_BUT.2 1.27,8.29 v1.27,7.11 | C133.2 7.87,4.19 GPIO-2.2 | 6.86,14.48 v6.86,13.97 v5.97,13.97 5.97,14.76 | v27.3,7.62 v27.3,8.51 27.3,8.76 27.3,8.89 | 28.32,15.62 R36.2 R37.2 | 28.32,15.62 v28.45,15.62 | C103.2 28.32,15.62 | C104.2 36.07,13.97 35.81,14.22 v35.81,14.61 35.69,14.73 35.69,14.86 C81.1 36.32,15.75 C84.1 | C123.2 v48.26,6.1 C124.2 | C53.2 v56.39,16.89 | 59.94,6.1 C106.2 | 59.94,6.1 v60.96,6.1 62.36,6.1 R65.2 | UEXT.2 59.94,4.7 59.94,6.1 | 62.1,11.3 v61.21,11.3 60.96,11.3 v60.33,11.3 59.69,11.3 | C108.2 64.01,15.37 64.01,13.72 v63.88,13.72 | RECOVERY.2 60.71,22.23 v60.71,23.88 v60.71,24.77 v60.71,25.65 | USB_HOST.1.4 11.84,31.11 13.34,31.11 15.49,28.96
  Top 1.27: 10.79,23.62 L3.1 | C95.2 17.53,13.08 C93.2 C94.2 13.46,13.08
  Top 1.524: 68.71,9.4 68.71,8.57 HDMI.SH4 HDMI.SH3 | HDMI.SH2 HDMI.SH1 68.71,23.18 68.71,22.35
  GND 0.107: 29.25,29.9 32.17,29.9 | 29.25,30.55 33.15,30.55 | 29.25,31.2 35.42,31.2 | 29.25,31.85 35.42,31.85 | 28.93,32.5 35.42,32.5 | 28.93,33.15 33.15,33.15 | 29.25,33.8 33.15,33.8 | 29.25,34.45 32.17,34.45 | 32.17,34.45 33.15,34.45 | 29.25,29.25 34.12,29.25 | 29.57,27.95 30.23,27.95 | 29.57,27.95 29.25,27.95 | 30.23,27.95 32.17,27.95 | 32.17,27.95 34.12,27.95 | 29.25,28.6 34.12,28.6 | 28.27,26.65 33.15,26.65 | 28.27,26 34.77,26 | 28.27,25.35 34.77,25.35 | 28.27,27.3 34.77,27.3 | 33.48,23.73 33.48,26.98 | 32.83,23.73 32.83,26.98 | 32.17,27.95 32.17,23.73 | 30.23,27.95 30.23,23.73 | 29.57,23.4 29.57,27.95 | 28.93,23.4 28.93,27.62 | 38.02,27.95 43.55,27.95 | 38.02,28.6 43.88,28.6 | 37.38,29.25 43.88,29.25 | 37.38,29.9 43.55,29.9 | 38.35,30.55 43.55,30.55 | 38.35,31.2 43.55,31.2 | 38.35,31.85 43.55,31.85 | 38.35,32.5 43.55,32.5 | 38.35,33.15 43.55,33.15 | 38.35,33.8 42.9,33.8 43.23,33.48 | 38.02,34.45 42.9,34.45 | 36.4,35.1 43.55,35.1 | 36.73,35.75 43.23,35.75 | 36.73,36.4 43.23,36.4 | 34.77,34.77 34.77,38.67 | U1.J16 34.12,38.67 | 33.48,34.45 33.48,38.67 | 32.17,34.45 32.17,38.67
  GND 0.508: 10.92,44.45 9.65,45.72 7.11,45.72
  GND 0.762: v35.1,28.93 v35.1,28.92 35.1,24.84
  GND 1.016: 4.32,31.88 4.57,31.88 | 4.32,31.88 v4.32,31.5 2.03,29.21 2.03,23.75 v3.81,23.75 | 4.32,31.88 v4.32,32.38 v4.32,34.92 v4.32,35.81
  GND 1.524: 15.88,29.72 14.8,30.79 USB_HOST.1.4 USB_HOST.2.4 8.71,30.79 7.62,31.88 4.57,31.88 | HDMI.SH3 HDMI.SH4 68.45,8.57 68.45,10.41 | HDMI.SH2 HDMI.SH1 68.45,23.18 68.45,21.59 | UEXT.2 59.05,5.97 | GPIO-2.2 8.26,5.84 | 15.11,42.67 UART0-DBG.3 10.92,44.45 UART0-DBG.4 | GPIO-1.2 9.14,48.64 | GND_PIN.P$1 62.23,49.53
  Route3 0.254: v16.76,39.37 16.76,42.04 17.53,42.8
  Route3 1.016: GND_PIN.P$1 61.85,49.53
  Route3 1.524: 71.5,9.91 71.5,8.57 HDMI.SH4 68.33,8.57 68.33,10.29 | 71.37,21.08 71.37,23.18 HDMI.SH1 68.71,23.18 68.71,21.08 | HDMI.SH2 74.55,23.18 74.55,19.3 | HDMI.SH3 74.3,8.57 74.3,10.67
  Route14 0.254: v16.76,39.37 16.76,39.75 15.88,40.64
  Route14 0.508: 15.88,40.64 15.88,41.78
  Route14 1.524: 76.2,10.29 76.2,8.57 HDMI.SH4 68.45,8.57 68.45,11.3 | 71.5,20.7 71.5,23.18 HDMI.SH1 68.58,23.18 68.58,20.95 | HDMI.SH2 74.04,23.18 74.04,21.72
  Bottom 0.107: 28.93,33.15 30.23,33.15 | 30.23,33.15 30.88,33.15 | 30.88,33.15 31.52,33.15 31.52,31.21 | 28.93,32.5 31.52,32.5 | 28.93,31.85 31.52,31.85 | 28.93,31.2 31.52,31.2 | 30.88,33.15 30.88,31.21 | 30.23,33.15 30.23,31.21
  Bottom 0.127: v33.8,30.23 33.33,30.7 33.33,30.84 C73.1 | C80.1 43.18,28.96 43.18,28.88 | 28.83,33.26 28.93,33.15
  Bottom 0.254: 29.21,28.45 28.83,28.83 28.83,33.26 28.83,37.08 | 28.83,37.08 28.83,37.85 v29.21,38.23 35.05,44.07 v35.81,44.07 | v26.92,40.13 27.56,40.13 31.11,43.69 | 31.11,43.69 33.15,45.72 v33.15,45.85 | v26.92,40.13 26.92,39.5 26.16,38.73 26.16,26.92 27.81,25.27 28.19,25.27 | v62.61,19.94 62.61,19.56 59.05,16 44.07,16 | 60.33,12.06 v60.33,11.3 | 60.33,12.06 42.04,12.06 34.8,19.3 32.64,19.3 31.75,20.19 v31.5,20.19 | 60.33,12.06 61.47,12.06 63.12,13.72 v63.88,13.72 | C61.1 35.05,25.07 v34.45,25.68 | 43.18,28.88 43.18,28.57 R11.1 44.7,28.07 | v50.9,24 50.7,23.8 50.7,23.5 50.19,22.99 C12.1 | 31.11,43.69 30.23,43.69 29.97,43.94 | 28.83,37.08 29.21,37.08 | v26.92,40.13 26.8,40.26 26.8,41.27 28.96,43.43 30.73,43.43 | 64.9,10.03 69.09,10.03
  Bottom 0.305: C71.1 32.64,28.42 v33.15,28.93 | C59.1 35.61,28.13 34.96,27.48 C88.1 | v55,31.6 55,32.6 55.2,32.8 C26.1